# EAGLE design PLA_Main_Gen2_Rev4_BOMREV2 (EAGLE 7.7.0)

## Sheet 1 of 2: Atmega
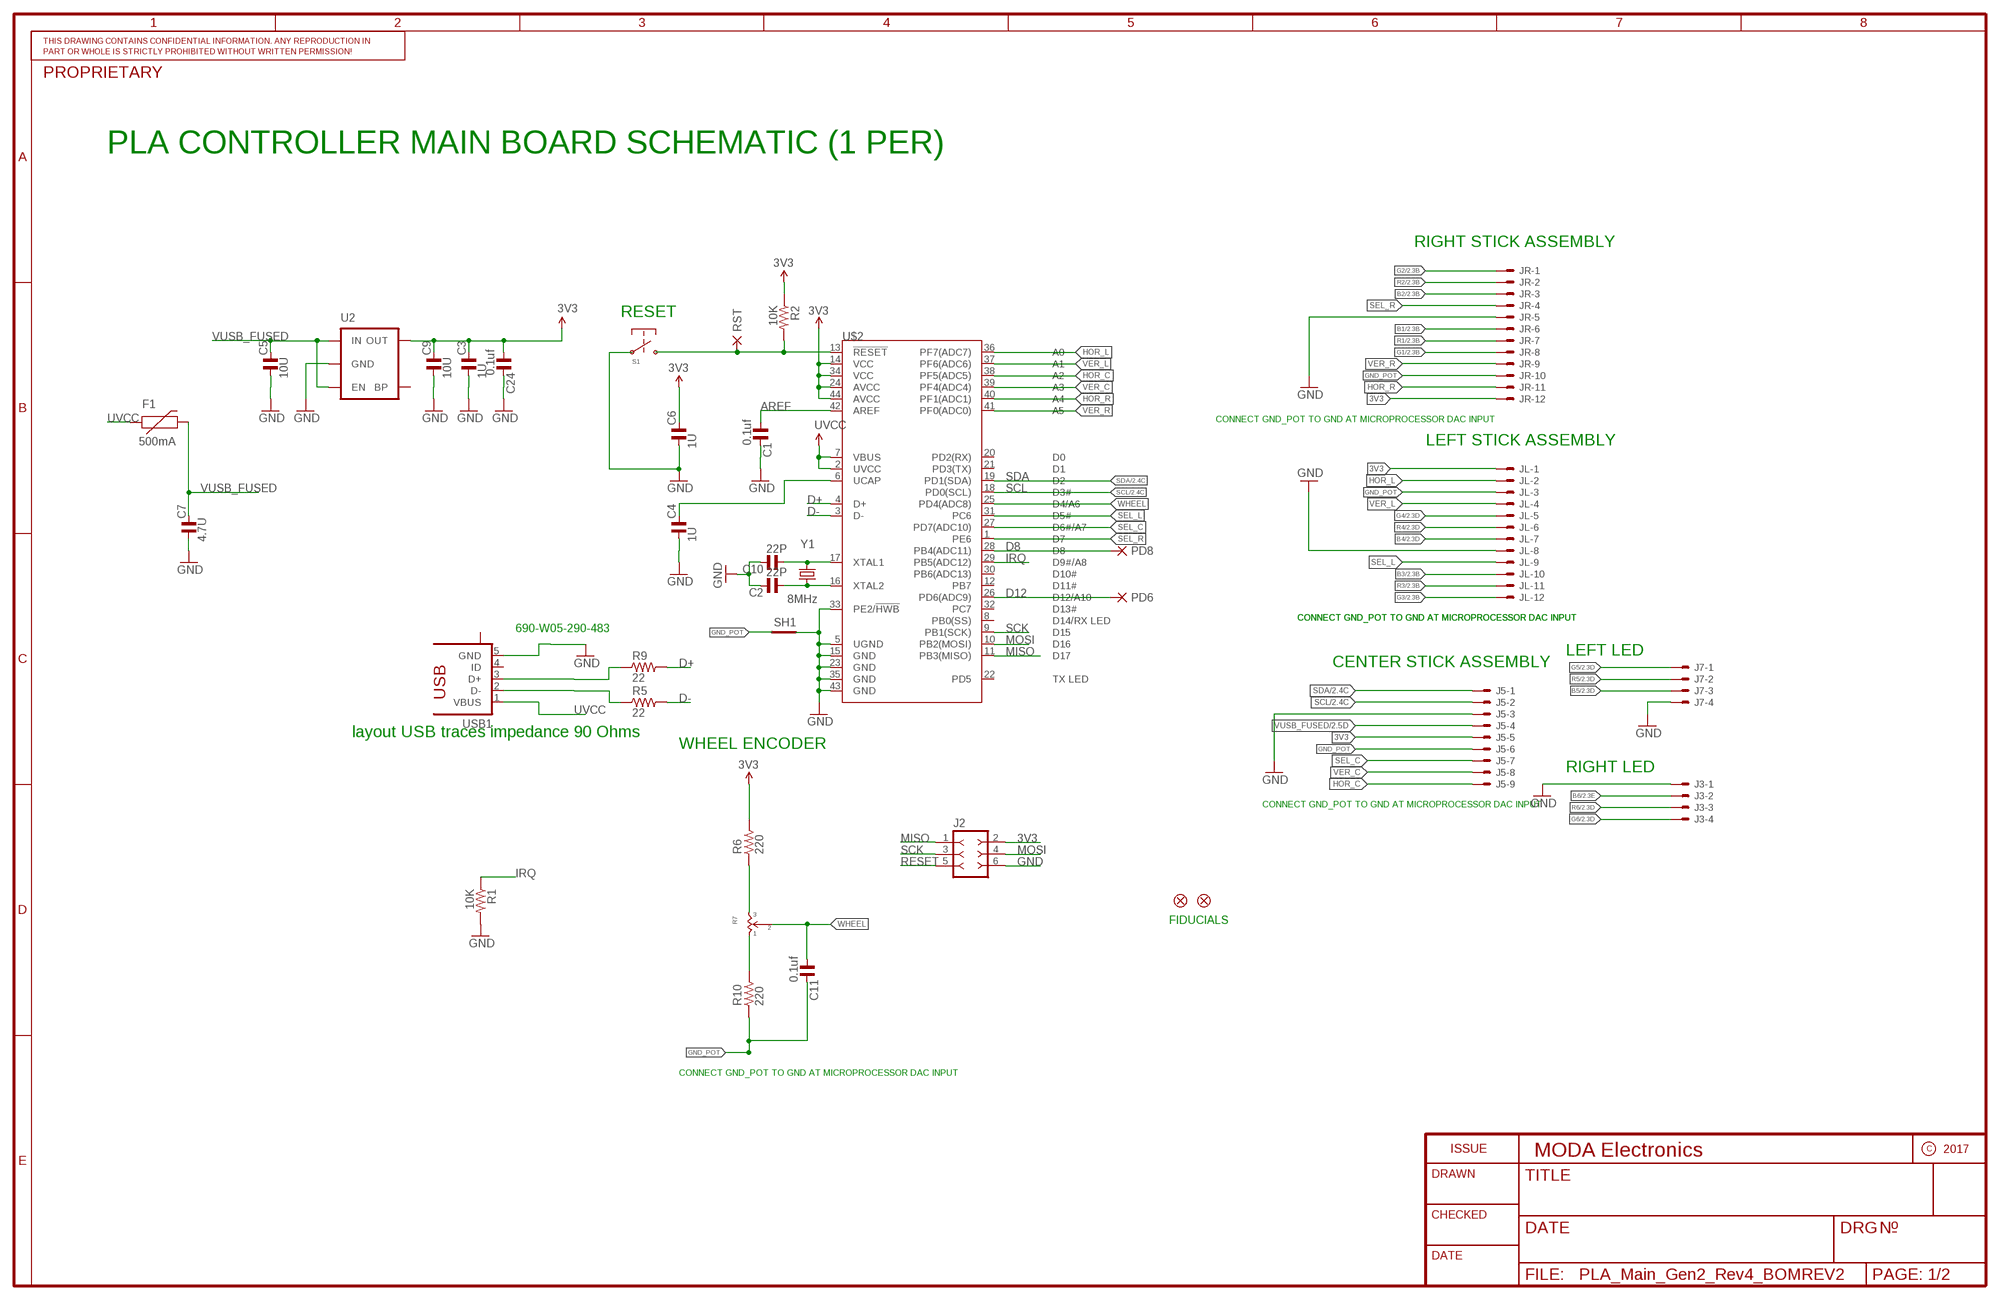
[diagram p0: schematic, sheet 1]

### Parts
C1  0.1uf  C_0603  [C0603]
C2  22P  C_0603  [C0603]
C3  1U  C_0603  [C0603]
C4  1U  C_0603  [C0603]
C5  10U  C_1206  [C1206]
C6  1U  C_0603  [C0603]
C7  4.7U  C_0603  [C0603]
C9  10U  C_1206  [C1206]
C10  22P  C_0603  [C0603]
C11  0.1uf  C_0603  [C0603]
C24  0.1uf  C_0603  [C0603]
F1  500mA  PTCSMD  [PTC-1206]
J2  F-2X03-DIL-100  [DIL-100-2X03]
J3  SM04B-SRSS-TB  [SM04B-SRSS-TB]
J5  SM09B-SRSS-TB  [SM09B-SRSS-TB]
J7  SM04B-SRSS-TB  [SM04B-SRSS-TB]
JL  SM12B-SRSS-TB  [SM12B-SRSS-TB]
JP1  FIDUCIALUFIDUCIAL  [MICRO-FIDUCIAL]
JP2  FIDUCIALUFIDUCIAL  [MICRO-FIDUCIAL]
JR  SM12B-SRSS-TB  [SM12B-SRSS-TB]
PD6  PAD-SMD12R  [SMD12R]
PD8  PAD-SMD12R  [SMD12R]
R1  10K  R_0603  [R0603]
R2  10K  R_0603  [R0603]
R5  22  R_0603  [R0603]
R6  220  R_0603  [R0603]
R7  SV01A103AEA01R00  [SV01A103AEA01R00]
R9  22  R_0603  [R0603]
R10  220  R_0603  [R0603]
RST  PAD-SMD10R  [SMD10R]
S1  KMR211GLFS  [KMR211GLFS]
SH1  SHORTT5  [SHORT_TOP-50]
U2  V_REG_LDOSMD  [SOT23-5]
U$2  ATMEGA32U4QFN  [QFN-44]
USB1  10118192-0001LF  [10118192-0001LF]
Y1  8MHz  CRYSTAL5X3  [CRYSTAL-SMD-5X3]

### Nets
3V3: C3.2 C6.2 C9.2 C24.1 J2.2 J5.5 JL.1 JR.12 R2.1 R6.2 U2.5(OUT) U$2.14(VCC) U$2.24(AVCC) U$2.34(VCC) U$2.44(AVCC) ; also sheet 2
AREF: C1.1 U$2.42(AREF)
B1: JR.6 ; also sheet 2
B2: JR.3 ; also sheet 2
B3: JL.10 ; also sheet 2
B4: JL.7 ; also sheet 2
B5: J7.3 ; also sheet 2
B6: J3.2 ; also sheet 2
D8: PD8.PAD(P) U$2.28(PB4(ADC11))
D12: PD6.PAD(P) U$2.26(PD6(ADC9))
D+ [diff90]: R9.2 U$2.4(D+)
D- [diff90]: R5.2 U$2.3(D-)
G1: JR.8 ; also sheet 2
G2: JR.1 ; also sheet 2
G3: JL.12 ; also sheet 2
G4: JL.5 ; also sheet 2
G5: J7.1 ; also sheet 2
G6: J3.4 ; also sheet 2
GND [vcc]: C1.2 C2.2 C3.1 C4.1 C5.1 C6.1 C7.1 C9.1 C10.2 C24.2 J2.6 J3.1 J5.3 J7.4 JL.8 JR.5 R1.2 S1.1A S1.1B SH1.2 U2.2(GND) U$2.5(UGND) U$2.15(GND) U$2.23(GND) U$2.33(PE2/!HWB) U$2.35(GND) U$2.43(GND) USB1.5(GND) ; also sheet 2
GND_POT [vcc]: C11.2 J5.6 JL.3 JR.10 R10.1 SH1.1
HOR_C: J5.9 U$2.38(PF5(ADC5))
HOR_L: JL.2 U$2.36(PF7(ADC7))
HOR_R: JR.11 U$2.40(PF1(ADC1))
IRQ: R1.1 U$2.29(PB5(ADC12))
MISO: J2.1 U$2.11(PB3(MISO))
MOSI: J2.4 U$2.10(PB2(MOSI))
N$1: C2.1 U$2.16(XTAL2) Y1.1
N$2: C10.1 U$2.17(XTAL1) Y1.3
N$4: C4.2 U$2.6(UCAP)
N$7: R6.1 R7.3
N$10: R7.1 R10.2
R1: JR.7 ; also sheet 2
R2: JR.2 ; also sheet 2
R3: JL.11 ; also sheet 2
R4: JL.6 ; also sheet 2
R5: J7.2 ; also sheet 2
R6: J3.3 ; also sheet 2
RESET: J2.5 R2.2 RST.PAD(P) S1.2A S1.2B U$2.13(!RESET)
SCK: J2.3 U$2.9(PB1(SCK))
SCL: J5.2 U$2.18(PD0(SCL)) ; also sheet 2
SDA: J5.1 U$2.19(PD1(SDA)) ; also sheet 2
SEL_C: J5.7 U$2.27(PD7(ADC10))
SEL_L: JL.9 U$2.31(PC6)
SEL_R: JR.4 U$2.1(PE6)
USB_N [diff90]: R5.1 USB1.2(D-)
USB_P [diff90]: R9.1 USB1.3(D+)
UVCC: F1.1 U$2.2(UVCC) U$2.7(VBUS) USB1.1(VBUS)
VER_C: J5.8 U$2.39(PF4(ADC4))
VER_L: JL.4 U$2.37(PF6(ADC6))
VER_R: JR.9 U$2.41(PF0(ADC0))
VUSB_FUSED: C5.2 C7.2 F1.2 J5.4 U2.1(IN) U2.3(EN) ; also sheet 2
WHEEL: C11.1 R7.2 R7.2A U$2.25(PD4(ADC8))
Unconnected: U2.4(BP) U$2.8(PB0(SS)) U$2.12(PB7) U$2.20(PD2(RX)) U$2.21(PD3(TX)) U$2.22(PD5) U$2.30(PB6(ADC13)) U$2.32(PC7) USB1.4(ID) USB1.M1(S) USB1.M2(S) USB1.S1(S) USB1.S2(S) USB1.S3(S) USB1.S4(S)

### Notes on the sheet
- PLA CONTROLLER MAIN BOARD SCHEMATIC (1 PER)
- RIGHT STICK ASSEMBLY
- RESET
- CONNECT GND_POT TO GND AT MICROPROCESSOR DAC INPUT
- LEFT STICK ASSEMBLY
- CONNECT GND_POT TO GND AT MICROPROCESSOR DAC INPUT | CONNECT GND_POT TO GND AT MICROPROCESSOR DAC INPUT
- 690-W05-290-483
- LEFT LED
- CENTER STICK ASSEMBLY
- layout USB traces impedance 90 Ohms
- WHEEL ENCODER
- RIGHT LED
- CONNECT GND_POT TO GND AT MICROPROCESSOR DAC INPUT
- FIDUCIALS
- CONNECT GND_POT TO GND AT MICROPROCESSOR DAC INPUT

## Sheet 2 of 2: Color LED
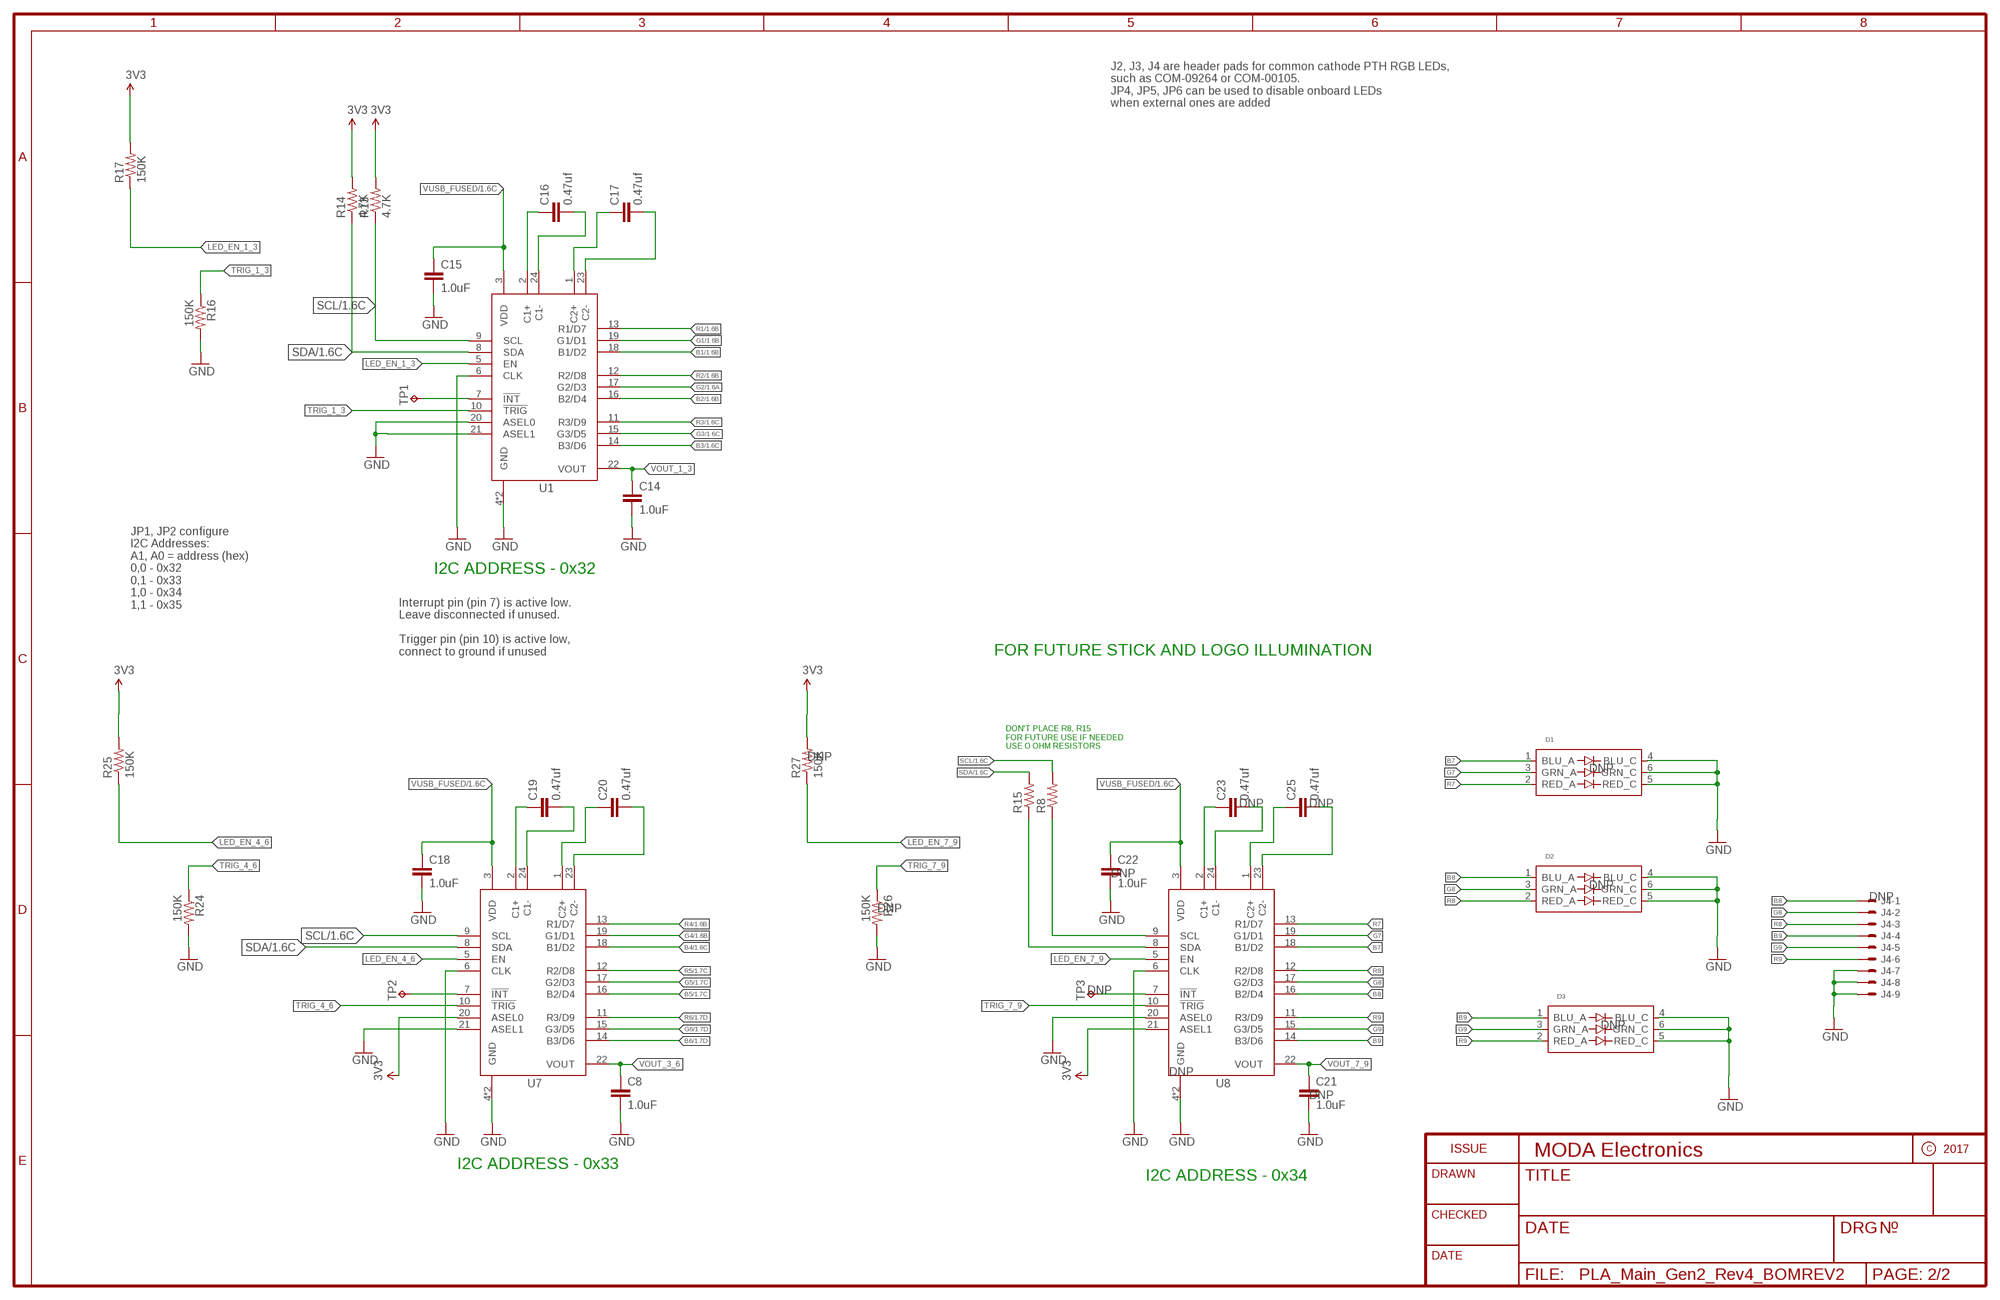
[diagram p1: schematic, sheet 2]

### Parts
C8  1.0uF  1.0UF-16V-10%(0603)  [0603-CAP]
C14  1.0uF  1.0UF-16V-10%(0603)  [0603-CAP]
C15  1.0uF  1.0UF-16V-10%(0603)  [0603-CAP]
C16  0.47uf  CAP0603-CAP  [0603-CAP]
C17  0.47uf  CAP0603-CAP  [0603-CAP]
C18  1.0uF  1.0UF-16V-10%(0603)  [0603-CAP]
C19  0.47uf  CAP0603-CAP  [0603-CAP]
C20  0.47uf  CAP0603-CAP  [0603-CAP]
C21  1.0uF  1.0UF-16V-10%(0603)  [0603-CAP]
C22  1.0uF  1.0UF-16V-10%(0603)  [0603-CAP]
C23  0.47uf  CAP0603-CAP  [0603-CAP]
C25  0.47uf  CAP0603-CAP  [0603-CAP]
D1  XZFBBM2ACRDG92W-3  [XZFBBM2ACRDG92W-3]
D2  XZFBBM2ACRDG92W-3  [XZFBBM2ACRDG92W-3]
D3  XZFBBM2ACRDG92W-3  [XZFBBM2ACRDG92W-3]
J4  BM09B-SRSS-TB  [BM09B-SRSS-TB]
R8  4.7KOHM-1/10W-1%(0603)  [0603-RES]
R13  4.7K  4.7KOHM-1/10W-1%(0603)  [0603-RES]
R14  4.7K  4.7KOHM-1/10W-1%(0603)  [0603-RES]
R15  4.7KOHM-1/10W-1%(0603)  [0603-RES]
R16  150K  150KOHM1/10W1%(0603)  [0603-RES]
R17  150K  150KOHM1/10W1%(0603)  [0603-RES]
R24  150K  150KOHM1/10W1%(0603)  [0603-RES]
R25  150K  150KOHM1/10W1%(0603)  [0603-RES]
R26  150K  150KOHM1/10W1%(0603)  [0603-RES]
R27  150K  150KOHM1/10W1%(0603)  [0603-RES]
TP1  TP-040  [TP-040]
TP2  TP-040  [TP-040]
TP3  TP-040  [TP-040]
U1  LP55231WQFN  [WQFN-24]
U7  LP55231WQFN  [WQFN-24]
U8  LP55231WQFN  [WQFN-24]

### Nets
3V3: R13.2 R14.2 R17.2 R25.2 R27.2 U7.20(ASEL0) U8.21(ASEL1) ; also sheet 1
B1: U1.18(B1/D2) ; also sheet 1
B2: U1.16(B2/D4) ; also sheet 1
B3: U1.14(B3/D6) ; also sheet 1
B4: U7.18(B1/D2) ; also sheet 1
B5: U7.16(B2/D4) ; also sheet 1
B6: U7.14(B3/D6) ; also sheet 1
B7: D1.1(BLU_A) U8.18(B1/D2)
B8: D2.1(BLU_A) J4.1 U8.16(B2/D4)
B9: D3.1(BLU_A) J4.4 U8.14(B3/D6)
G1: U1.19(G1/D1) ; also sheet 1
G2: U1.17(G2/D3) ; also sheet 1
G3: U1.15(G3/D5) ; also sheet 1
G4: U7.19(G1/D1) ; also sheet 1
G5: U7.17(G2/D3) ; also sheet 1
G6: U7.15(G3/D5) ; also sheet 1
G7: D1.3(GRN_A) U8.19(G1/D1)
G8: D2.3(GRN_A) J4.2 U8.17(G2/D3)
G9: D3.3(GRN_A) J4.5 U8.15(G3/D5)
GND [vcc]: C8.2 C14.2 C15.2 C18.2 C21.2 C22.2 D1.4(BLU_C) D1.5(RED_C) D1.6(GRN_C) D2.4(BLU_C) D2.5(RED_C) D2.6(GRN_C) D3.4(BLU_C) D3.5(RED_C) D3.6(GRN_C) J4.7 J4.8 J4.9 R16.2 R24.2 R26.2 U1.4(GND) U1.6(CLK) U1.20(ASEL0) U1.21(ASEL1) U1.EP(GND) U7.4(GND) U7.6(CLK) U7.21(ASEL1) U7.EP(GND) U8.4(GND) U8.6(CLK) U8.20(ASEL0) U8.EP(GND) ; also sheet 1
LED_EN_1_3: R17.1 U1.5(EN)
LED_EN_4_6: R25.1 U7.5(EN)
LED_EN_7_9: R27.1 U8.5(EN)
N$3: TP1.1 U1.7(!INT)
N$5: C19.1 U7.2(C1+)
N$9: C19.2 U7.24(C1-)
N$11: C16.1 U1.2(C1+)
N$12: C16.2 U1.24(C1-)
N$13: C17.1 U1.1(C2+)
N$14: C17.2 U1.23(C2-)
N$21: C20.1 U7.1(C2+)
N$22: C20.2 U7.23(C2-)
N$23: TP2.1 U7.7(!INT)
N$24: C23.1 U8.2(C1+)
N$25: C23.2 U8.24(C1-)
N$26: C25.1 U8.1(C2+)
N$27: C25.2 U8.23(C2-)
N$28: TP3.1 U8.7(!INT)
R1: U1.13(R1/D7) ; also sheet 1
R2: U1.12(R2/D8) ; also sheet 1
R3: U1.11(R3/D9) ; also sheet 1
R4: U7.13(R1/D7) ; also sheet 1
R5: U7.12(R2/D8) ; also sheet 1
R6: U7.11(R3/D9) ; also sheet 1
R7: D1.2(RED_A) U8.13(R1/D7)
R8: D2.2(RED_A) J4.3 U8.12(R2/D8)
R9: D3.2(RED_A) J4.6 U8.11(R3/D9)
SCL: R8.2 R13.1 U1.9(SCL) U7.9(SCL) ; also sheet 1
SCL2: R8.1 U8.9(SCL)
SDA: R14.1 R15.2 U1.8(SDA) U7.8(SDA) ; also sheet 1
SDA2: R15.1 U8.8(SDA)
TRIG_1_3: R16.1 U1.10(!TRIG)
TRIG_4_6: R24.1 U7.10(!TRIG)
TRIG_7_9: R26.1 U8.10(!TRIG)
VOUT_1_3: C14.1 U1.22(VOUT)
VOUT_3_6: C8.1 U7.22(VOUT)
VOUT_7_9: C21.1 U8.22(VOUT)
VUSB_FUSED: C15.1 C18.1 C22.1 U1.3(VDD) U7.3(VDD) U8.3(VDD) ; also sheet 1

### Notes on the sheet
- J2, J3, J4 are header pads for common cathode PTH RGB LEDs,
  such as COM-09264 or COM-00105.  
  JP4, JP5, JP6 can be used to disable onboard LEDs 
  when external ones are added
- I2C ADDRESS - 0x32
- JP1, JP2 configure
  I2C Addresses:
  A1, A0 = address (hex)
  0,0 - 0x32
  0,1 - 0x33
  1,0 - 0x34
  1,1 - 0x35
- Interrupt pin (pin 7) is active low.  
  Leave disconnected if unused.
  
  Trigger pin (pin 10) is active low, 
  connect to ground if unused
- FOR FUTURE STICK AND LOGO ILLUMINATION
- DON'T PLACE R8, R15 
  FOR FUTURE USE IF NEEDED
  USE O OHM RESISTORS
- I2C ADDRESS - 0x33
- I2C ADDRESS - 0x34

## Library data of the parts
C1 C11 C24 = rc-master-smd:C_: NON-POLARIZED CAP; PARTNO: 64K2839
C2 C10 = rc-master-smd:C_: NON-POLARIZED CAP; PARTNO: 06035C220JAT2A
C3 C4 C6 = rc-master-smd:C_: NON-POLARIZED CAP; PARTNO: CL10B105KP8NNNC
C5 C9 = rc-master-smd:C_: NON-POLARIZED CAP; PARTNO: C3216X5R1H106K160AB
C7 = rc-master-smd:C_: NON-POLARIZED CAP; PARTNO: GRM188R61A475KE15D
C8 C14 C15 C18 = SparkFun-Capacitors:1.0UF-16V-10%(0603): CAP-00868; PARTNO: CL10B105KP8NNNC; PROD_ID: CAP-00868
C16 C19 = SparkFun-Capacitors:CAP: Capacitor Standard 0603 ceramic capacitor, and 0.1" leaded capacitor.; PARTNO: 0603YG474ZAT2A; PROD_ID: CAP-13216; SEE-ALSO: battery-babysitter
C17 C20 = SparkFun-Capacitors:CAP: Capacitor Standard 0603 ceramic capacitor, and 0.1" leaded capacitor.; PARTNO: 0603YG474ZAT2A; PROD_ID: CAP-13216; SEE-ALSO: battery bayasitter
C21 C22 = SparkFun-Capacitors:1.0UF-16V-10%(0603): CAP-00868; DNP: T; PARTNO: CL10B105KP8NNNC; PROD_ID: CAP-00868
C23 = SparkFun-Capacitors:CAP: Capacitor Standard 0603 ceramic capacitor, and 0.1" leaded capacitor.; DNP: T; PARTNO: 0603YG474ZAT2A; PROD_ID: CAP-13216; SEE-ALSO: battery-babysitter
C25 = SparkFun-Capacitors:CAP: Capacitor Standard 0603 ceramic capacitor, and 0.1" leaded capacitor.; DNP: T; PARTNO: 0603YG474ZAT2A; PROD_ID: CAP-13216; SEE-ALSO: battery bayasitter
D1-D3 = XZFBBM2ACRDG92W-3:XZFBBM2ACRDG92W-3: Red, Green, Blue (RGB) 625nm Red, 525nm Green, 470nm Blue LED Indication - Discrete 2.2V Red, 3.2V Green, 3.3V Blue 6-SMD, No Lead ( https://www.digikey.com/product-detail/en/sunled/XZFBBM2ACRDG92W-3/1497-1226-1-ND/5001279 ); DNP: T; PARTNO: XZFBBM2ACRDG92W-3
F1 = SparkFun:PTC: Resettable Fuse PTC Resettable Fuse. Spark Fun Electronics SKU : COM-08357; PARTNO: NANOSMDH075F-02
J2 = con-headers-jp:F-2X03-: FEMALE HEADER; DNP: T; PARTNO: *
J3 J7 = con-jst:?M04B-SRSS-TB: Disconnectable Crimp style connector, 1.0mm pitch 4 contacts; PARTNO: SM04B-SRSS-TB(LF)(SN)
J4 = con-jst:?M09B-SRSS-TB: Disconnectable Crimp style connector, 1.0mm pitch 9 contacts; DNP: T; PARTNO: BM09B-SRSS-TB
J5 = con-jst:?M09B-SRSS-TB: Disconnectable Crimp style connector, 1.0mm pitch 9 contacts; PARTNO: SM09B-SRSS-TB
JL JR = con-jst:?M12B-SRSS-TB: Disconnectable Crimp style connector, 1.0mm pitch 12 contacts; PARTNO: SM12B-SRSS-TB(LF)(SN)
JP1 JP2 = SparkFun:FIDUCIAL: Fiducial Alignment Points Various fiducial points for machine vision alignment.; DNP: T; PARTNO: *
PD6 PD8 RST = dpads:PAD: WIRE PAD Standard US Drill Sizes and SMD pads; BOM: EXCLUDE
R1 R2 = rc-master-smd:R_: RESISTOR; PARTNO: ERJ-PA3J103V
R5 R9 = rc-master-smd:R_: RESISTOR; PARTNO: ERJ-PA3J220V
R6 R10 = rc-master-smd:R_: RESISTOR; PARTNO: ERJ-PA3J221V
R7 = SV01A103AEA01R00:SV01A103AEA01R00: Resistive Sensor Rotary Position Hole for Shaft SMD (SMT) Tab ( https://www.digikey.in/product-detail/en/murata-electronics-north-america/SV01A103AEA01R00/490-7023-1-ND/3846220 ); PARTNO: SV01A103AEA01R00
R8 R15 = SparkFun-Resistors:4.7KOHM-1/10W-1%(0603): RES-07857; DNP: T; PARTNO: ERJ-PA3J472V; PROD_ID: RES-07857; VALUE: 4.7K
R13 R14 = SparkFun-Resistors:4.7KOHM-1/10W-1%(0603): RES-07857; PARTNO: ERJ-PA3J472V; PROD_ID: RES-07857
R16 R17 R24 R25 = SparkFun-Resistors:150KOHM1/10W1%(0603): RES-09117; PARTNO: ERJ-PA3J154V; PROD_ID: RES-09117
R26 R27 = SparkFun-Resistors:150KOHM1/10W1%(0603): RES-09117; DNP: T; PARTNO: ERJ-PA3J154V; PROD_ID: RES-09117
S1 = KMR211GLFS:KMR211GLFS: Tactile Switch SPST-NO Top Actuated Surface Mount ( https://www.digikey.in/product-detail/en/c-k/KMR211GLFS/401-1426-1-ND/550461 ); PARTNO: KMR211GLFS
SH1 = shorts:SHORT: Short between two nets; BOM: no; DNP: T; PARTNO: *
TP1-TP3 = keystone:TP: TEST POINT PCB Vertical Mount; DNP: T; PARTNO: *
U1 U7 = LP55231:LP55231; PARTNO: LP55231SQX/NOPB; PROD_ID: IC-13302
U2 = SparkFun:V_REG_LDO: Voltage Regulator LDO Standard 150mA LDO voltage regulator in SOT-23 layout. Micrel part MIC5205. BP (by-pass) pin is used to lower output noise with 470pF cap.; PARTNO: MIC5219-3.3YM5-TR
U8 = LP55231:LP55231; DNP: T; PARTNO: LP55231SQX/NOPB; PROD_ID: IC-13302
U$2 = PLA_Controller_rev1:ATMEGA32U4: Atmel 44-pin 8-bit Microcontroller with 32KBytes of ISP Flash and USB Controller; PARTNO: ATMEGA32U4-MU
USB1 = Wagz_flex_rev22_test:10118192-0001LF: USB - microUSB Type B, FCI; PARTNO: 10118192-0001LF
Y1 = SparkFun:CRYSTAL: Crystals Various standard crystals. Proven footprints. Spark Fun Electronics SKU : COM-00534; PARTNO: ABM3B-8.000MHZ-B2-T

## Net classes
0 default: width 0.203 mm, drill 0.305 mm, clearance 0.178 mm
1 vcc: width 0.203 mm, drill 0.305 mm, clearance 0.178 mm
3 diff90: width 0.406 mm, drill 0.356 mm, clearance 0.254 mm

## Board
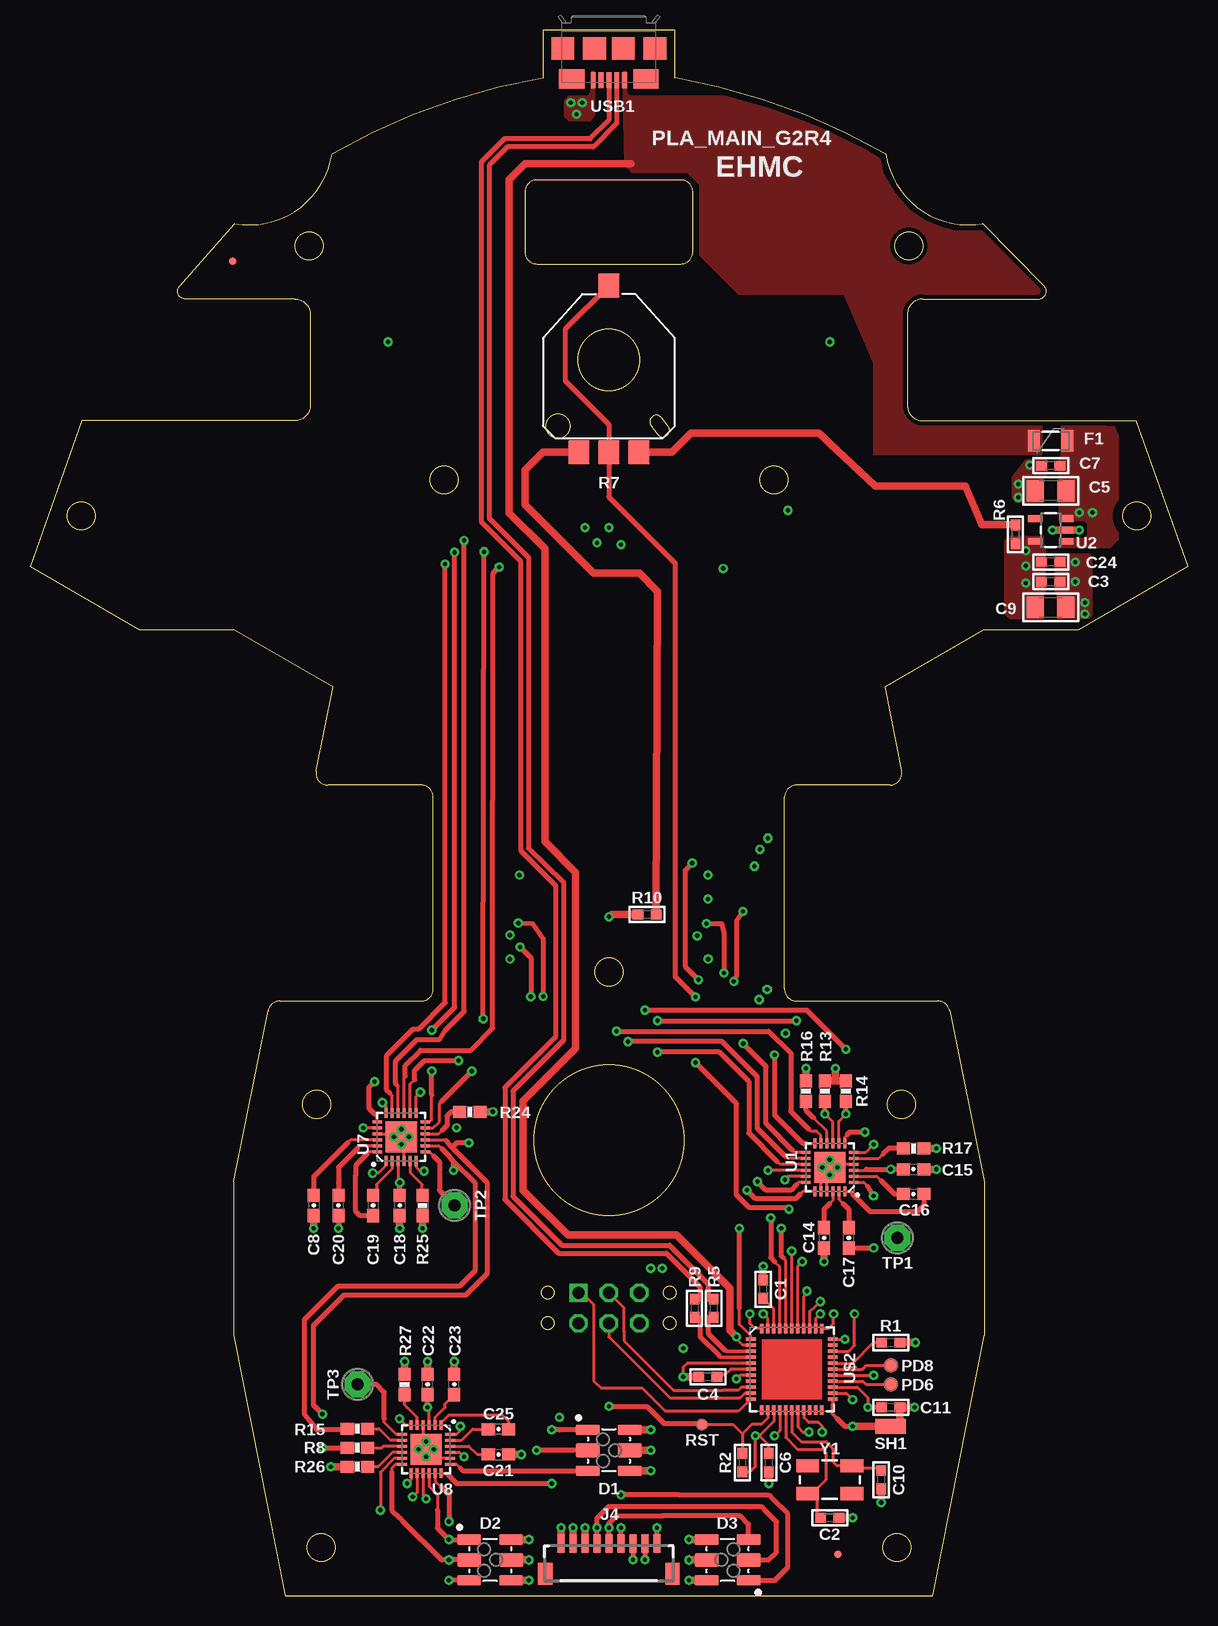
[diagram p2: board, top side]
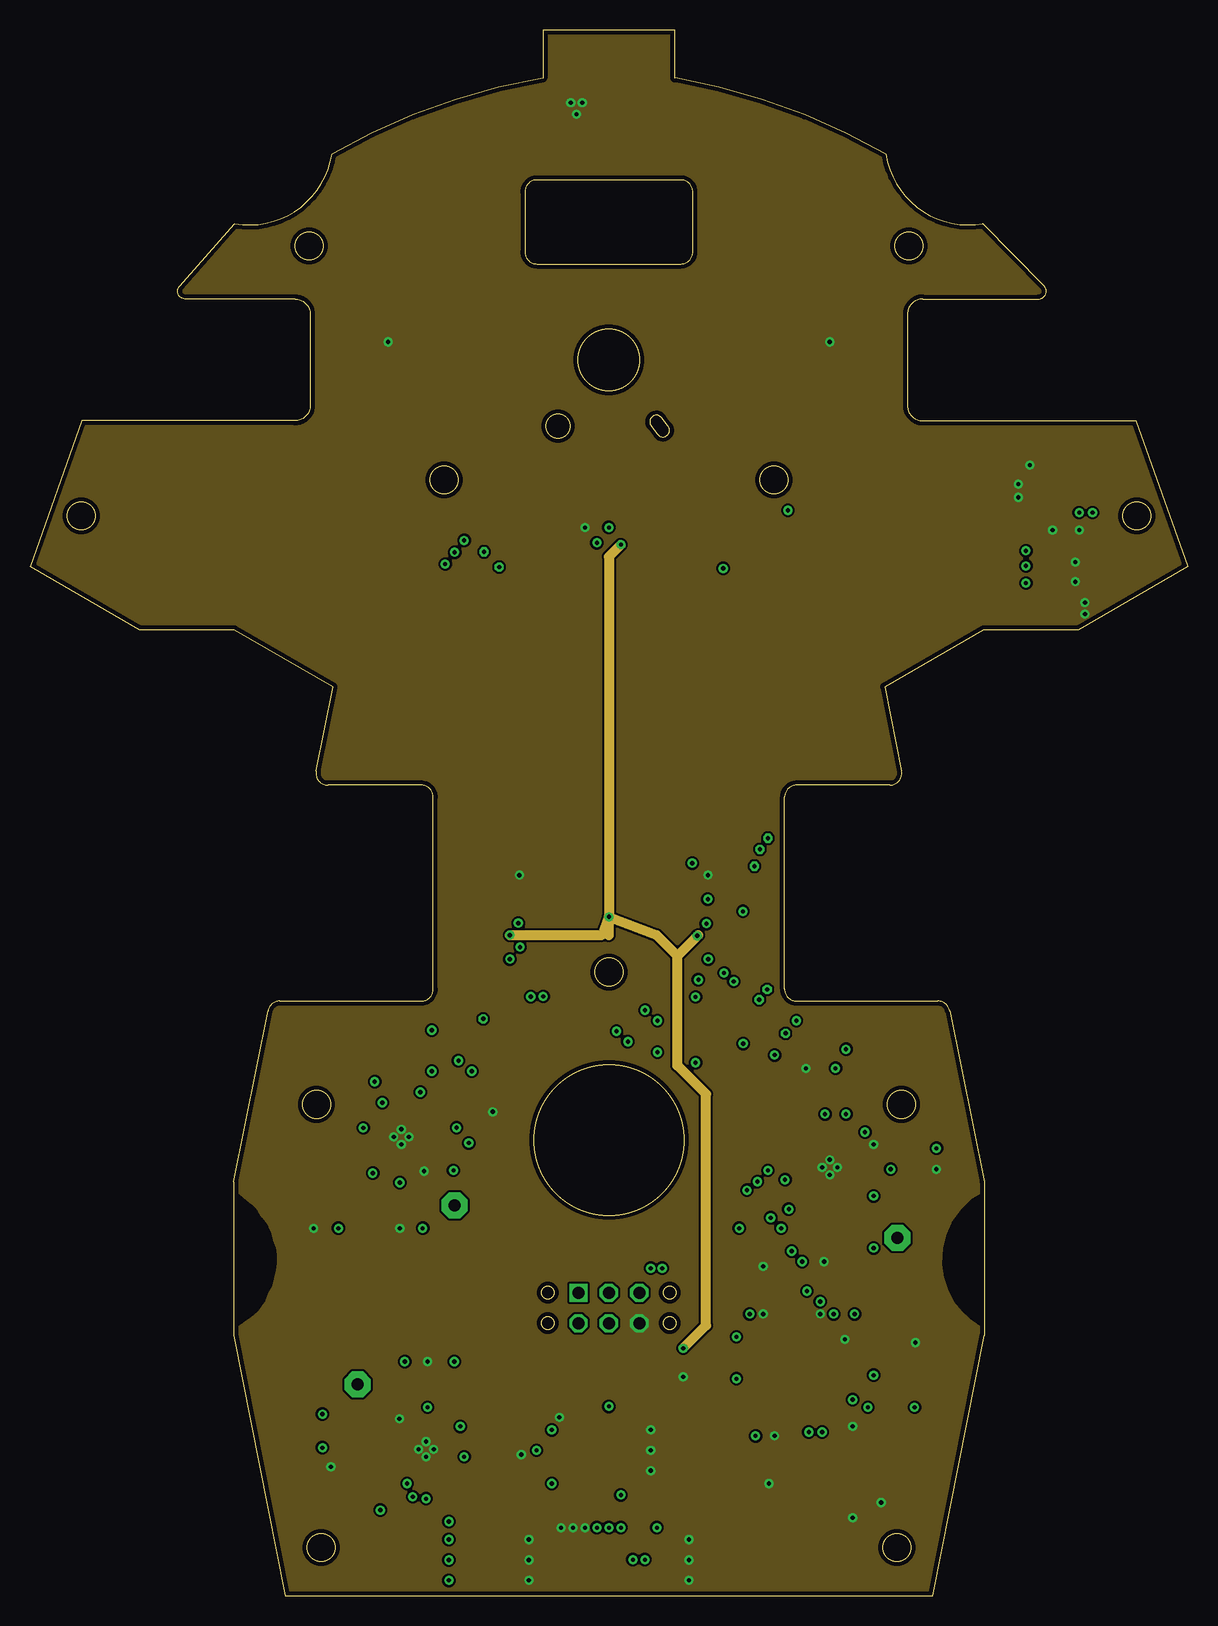
[diagram p3: board, inner layer GND]
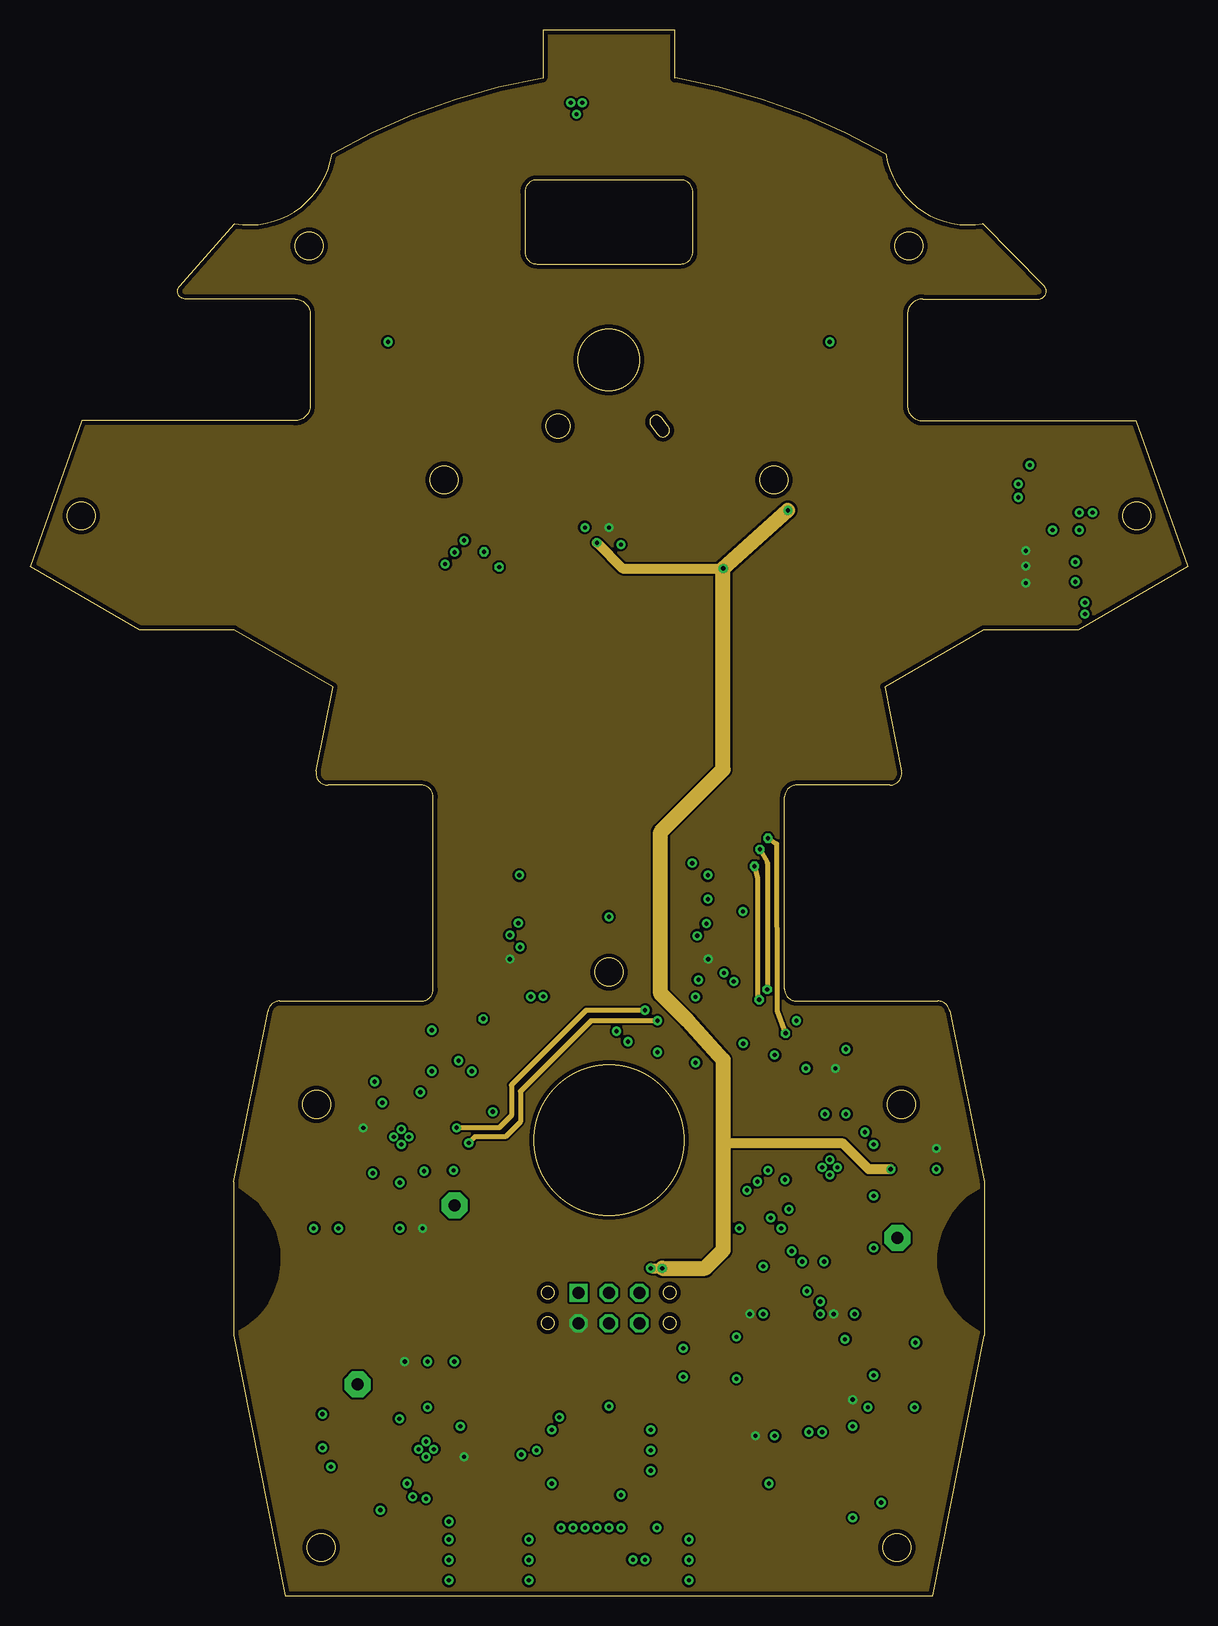
[diagram p4: board, inner layer Route15]
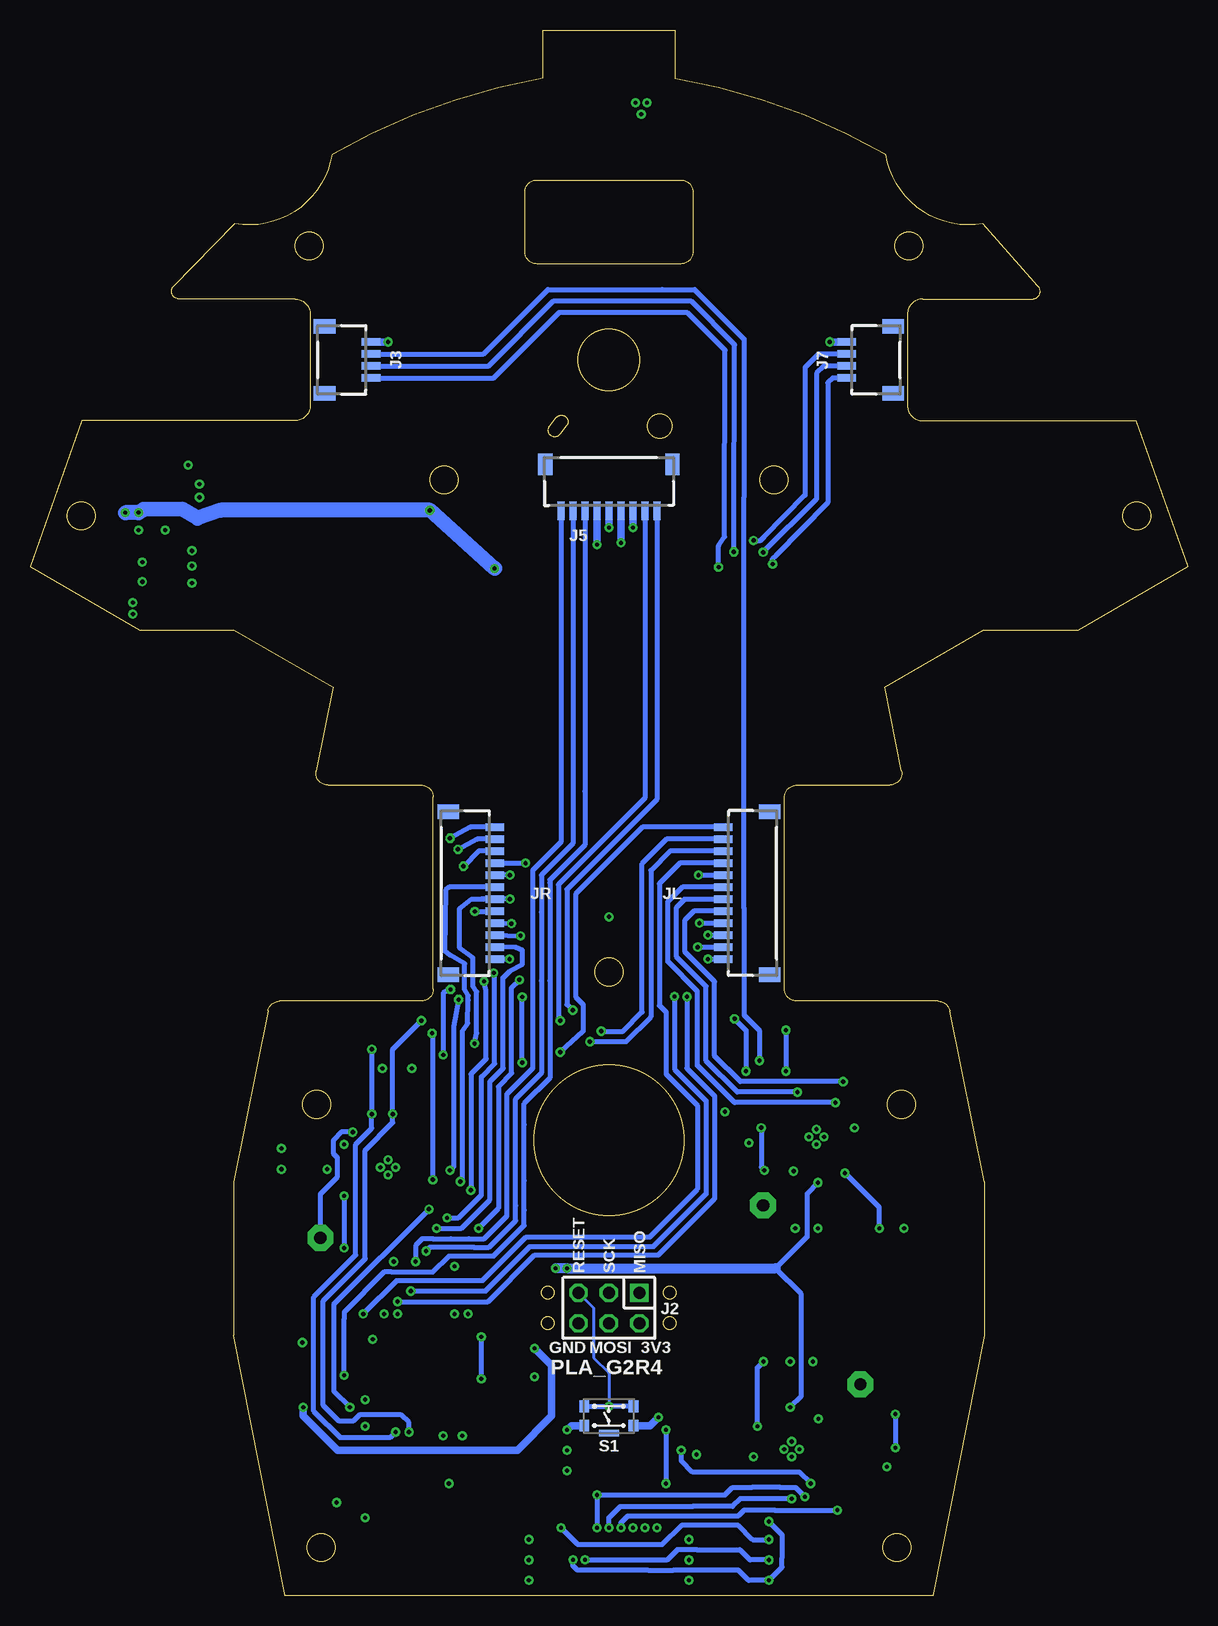
[diagram p5: board, bottom side, seen from below]

Size 96.52 x 130.5 mm. Coordinates in mm from the lower left corner, seen from the top.
Outline: 52.33,96.79 arc180 53.2,97.46 52.65,98.18 arc180 51.78,97.51 52.33,96.79
Outline: 41.26,117 41.26,112 arc90 42.26,111 54.26,111 arc90 55.26,112 55.26,117 arc90 54.26,118 42.26,118 arc90 41.26,117
Outline: 25.26,75.75 17.03,80.5 9.14,80.5 0,85.78 4.32,97.92 22.1,97.92 arc90 23.37,99.19 23.37,106.81 arc90 22.1,108.08 12.94,108.08 arc-134 12.49,109.16 17.07,114.35 arc91 25.17,120.13 arc-20 42.76,126.5 42.76,130.5 53.76,130.5 53.76,126.5 arc-20 71.35,120.13 arc91 79.46,114.35 84.54,109.16 arc-134 84.09,108.08 74.42,108.08 arc90 73.15,106.81 73.15,99.19 arc90 74.42,97.92 92.2,97.92 96.52,85.78 87.38,80.5 79.49,80.5 71.26,75.75 72.66,68.75 arc-101 71.68,67.55 63.9,67.55 arc90 62.9,66.55 62.9,50.55 arc90 63.9,49.55 75.69,49.55 arc-79 76.67,48.75 79.56,34.5 79.56,21.7 75.26,0 21.26,0 16.96,21.7 16.96,34.5 19.85,48.75 arc-79 20.83,49.55 32.62,49.55 arc90 33.62,50.55 33.62,66.55 arc90 32.62,67.55 24.84,67.55 arc-101 23.86,68.75 25.26,75.75
Outline: circle at 48.26,103 radius 2.55
Outline: circle at 48.26,37.96 radius 6.25
Outline: circle at 44.03,97.49 radius 1
Outline: circle at 34.51,93 radius 1.15
Outline: circle at 73.26,112.5 radius 1.15
Outline: circle at 92.26,90 radius 1.15
Outline: circle at 4.26,90 radius 1.15
Outline: circle at 72.26,4 radius 1.15
Outline: circle at 48.26,51.97 radius 1.15
Outline: circle at 23.88,40.94 radius 1.15
Outline: circle at 23.26,112.5 radius 1.15
Outline: circle at 24.26,4 radius 1.15
Outline: circle at 72.64,40.94 radius 1.15
Outline: circle at 62.01,93 radius 1.15
Outline: circle at 53.34,25.23 radius 0.51
Outline: circle at 43.18,25.23 radius 0.51
Outline: circle at 53.34,22.69 radius 0.51
Outline: circle at 43.18,22.69 radius 0.51
Copper layers (1+2*15+16): Top 0.035mm / dielectric 0.3mm / GND 0.035mm / dielectric 0.85mm / Route15 0.035mm / dielectric 0.3mm / Bottom 0.035mm
Design rules "SSC-EAGLE-4Lyr_v1.0.0.3 *": minimum track width 7mil, minimum drill 12mil, track to track 7mil, track to pad 7mil, pad to pad 7mil, via to via 8mil, smd to smd 0mil, copper to edge 15mil, drill to drill 16mil, minimum pad ring 8mil, minimum via ring 8mil, stop-mask expansion 3mil, vias tented up to drill 14mil, thermal gap 10mil
bKeepout: area 67,0.1 to 79.2,22.4; area 17.3,0.1 to 29.5,22.4; area 37.5,16.7 to 59.1,31.2; area 17,31.5 to 28.6,46.5; area 67.9,31.5 to 79.5,46.5; area 0.6,85.5 to 9.8,93.8; area 90.5,85.5 to 95.9,93.8
tRestrict: area -63.6,-44.7 to -62.9,-44.6; area 2.3,88 to 6.3,92; area 90.3,88 to 94.3,92; area 46.3,50 to 50.3,54; area 21.9,38.9 to 25.9,42.9; area 70.6,38.9 to 74.6,42.9; area 70.3,2 to 74.3,6; area 22.3,2 to 26.3,6
bRestrict: area 2.3,88 to 6.3,92; area 90.3,88 to 94.3,92; area 46.3,50 to 50.3,54; area 21.9,38.9 to 25.9,42.9; area 70.6,38.9 to 74.6,42.9; area 70.3,2 to 74.3,6; area 22.3,2 to 26.3,6

### Footprints (pad centres in the part's own frame; a part is rotated, then mirrored left to right if it is on the bottom)
C0603 = smd 0.9 x 0.8: 1 -0.762,0; 2 0.762,0
C1206 = smd 1.4 x 1.8: 1 -1.27,0; 2 1.27,0
0603-CAP = smd 1.1 x 1: 1 -0.85,0; 2 0.85,0
XZFBBM2ACRDG92W-3 = smd 2 x 0.9: 1 -1.75,1.7; 3 -1.75,-1.7; 4 1.75,1.7; 6 1.75,-1.7 | smd 2 x 1.2: 2 -1.75,0; 5 1.75,0
PTC-1206 = smd 1 x 1.8: 1 -1.4,0; 2 1.4,0
DIL-100-2X03 = drill 1.016 square: 1 -2.54,-1.27 | drill 1.016 octagon: 2 -2.54,1.27; 3 0,-1.27; 4 0,1.27; 5 2.54,-1.27; 6 2.54,1.27
SM04B-SRSS-TB = smd 0.6 x 1.55: 1 -1.5,2.975; 2 -0.5,2.975; 3 0.5,2.975; 4 1.5,2.975 | smd 1.2 x 1.8: FIT@1 -2.8,-0.9; FIT@2 2.8,-0.9
BM09B-SRSS-TB = smd 0.6 x 1.55: 1 -4,-1.625; 2 -3,-1.625; 3 -2,-1.625; 4 -1,-1.625; 5 0,-1.625; 6 1,-1.625; 7 2,-1.625; 8 3,-1.625; 9 4,-1.625 | smd 1.2 x 1.8: FIT@1 5.3,0.9; FIT@2 -5.3,0.9
SM09B-SRSS-TB = smd 0.6 x 1.55: 1 -4,2.975; 2 -3,2.975; 3 -2,2.975; 4 -1,2.975; 5 0,2.975; 6 1,2.975; 7 2,2.975; 8 3,2.975; 9 4,2.975 | smd 1.2 x 1.8: FIT@1 -5.3,-0.9; FIT@2 5.3,-0.9
SM12B-SRSS-TB = smd 0.6 x 1.55: 1 -5.5,2.975; 2 -4.5,2.975; 3 -3.5,2.975; 4 -2.5,2.975; 5 -1.5,2.975; 6 -0.5,2.975; 7 0.5,2.975; 8 1.5,2.975; 9 2.5,2.975; 10 3.5,2.975; 11 4.5,2.975; 12 5.5,2.975 | smd 1.2 x 1.8: FIT@1 -6.8,-0.9; FIT@2 6.8,-0.9
MICRO-FIDUCIAL = smd 0.635 x 0.635: 1 0,0
SMD12R = smd 1.2 x 1.2: PAD 0,0
R0603 = smd 0.9 x 0.8: 1 -0.762,0; 2 0.762,0
SV01A103AEA01R00 = smd 1.8 x 2: 1 -2.5,-7.7; 2 0,-7.7; 2A 0,6.2; 3 2.5,-7.7
0603-RES = smd 1.1 x 1: 1 -0.85,0; 2 0.85,0
SMD10R = smd 1 x 1: PAD 0,0
KMR211GLFS = smd 0.9 x 1: 1A -2.05,0.8; 1B 2.05,0.8; 2A -2.05,-0.8; 2B 2.05,-0.8 | smd 1.7 x 0.55: M 0,1.425
SHORT_TOP-50 = smd 1.295 x 1.27: 1 0.635,0; 2 -0.635,0
TP-040 = drill 1.016 pad 2.159 octagon: 1 0,0
WQFN-24 = smd 0.8 x 0.25: 1 -2,1.25; 2 -2,0.75; 3 -2,0.25; 4 -2,-0.25; 5 -2,-0.75; 6 -2,-1.25; 13 2,-1.25; 14 2,-0.75; 15 2,-0.25; 16 2,0.25; 17 2,0.75; 18 2,1.25 | smd 0.25 x 0.8: 7 -1.25,-2; 8 -0.75,-2; 9 -0.25,-2; 10 0.25,-2; 11 0.75,-2; 12 1.25,-2; 19 1.25,2; 20 0.75,2; 21 0.25,2; 22 -0.25,2; 23 -0.75,2; 24 -1.25,2 | smd 2.6 x 2.6: EP 0,0
SOT23-5 = smd 0.55 x 1.2: 1 -0.95,-1.3; 2 0,-1.3; 3 0.95,-1.3; 4 0.95,1.3; 5 -0.95,1.3
QFN-44 = smd 0.8 x 0.3: 1 -3.4,2.5; 2 -3.4,2; 3 -3.4,1.5; 4 -3.4,1; 5 -3.4,0.5; 6 -3.4,0; 7 -3.4,-0.5; 8 -3.4,-1; 9 -3.4,-1.5; 10 -3.4,-2; 11 -3.4,-2.5; 23 3.4,-2.5; 24 3.4,-2; 25 3.4,-1.5; 26 3.4,-1; 27 3.4,-0.5; 28 3.4,0; 29 3.4,0.5; 30 3.4,1; 31 3.4,1.5; 32 3.4,2; 33 3.4,2.5 | smd 0.3 x 0.8: 12 -2.5,-3.4; 13 -2,-3.4; 14 -1.5,-3.4; 15 -1,-3.4; 16 -0.5,-3.4; 17 0,-3.4; 18 0.5,-3.4; 19 1,-3.4; 20 1.5,-3.4; 21 2,-3.4; 22 2.5,-3.4; 34 2.5,3.4; 35 2,3.4; 36 1.5,3.4; 37 1,3.4; 38 0.5,3.4; 39 0,3.4; 40 -0.5,3.4; 41 -1,3.4; 42 -1.5,3.4; 43 -2,3.4; 44 -2.5,3.4
10118192-0001LF = smd 0.4 x 1.35: 1 -1.3,4.1; 2 -0.65,4.1; 3 0,4.1; 4 0.65,4.1; 5 1.3,4.1 | smd 1.9 x 1.9: M1 -1.2,1.45; M2 1.2,1.45; S1 -3.85,1.45; S2 3.85,1.45 | smd 2.1 x 1.6: S3 -3.1,4; S4 3.1,4
CRYSTAL-SMD-5X3 = smd 1.9 x 1.1: 1 -1.85,-1.15; 2 1.85,-1.15; 3 1.85,1.15; 4 -1.85,1.15

### Placement (x,y rotation side)
C1  61.12,25.53 90 top
C2  66.68,6.48 0 top
C3  85.09,84.51 180 top
C4  56.52,18.23 0 top
C5  85.09,92.09 0 top
C6  61.6,11.08 90 top
C7  85.09,94.18 0 top
C8  23.66,32.52 270 top
C9  85.09,82.38 180 top
C10  70.96,9.66 270 top
C11  71.76,15.69 0 top
C14  66.2,29.82 270 top
C15  73.66,35.53 0 top
C16  73.66,33.47 0 top
C17  68.26,29.82 90 top
C18  30.83,32.52 270 top
C19  28.61,32.52 270 top
C20  25.72,32.52 90 top
C21  39.05,11.75 0 top
C22  33.15,17.59 90 top
C23  35.37,17.59 90 top
C24  85.09,86.15 0 top
C25  39.05,13.87 180 top
D1  48.26,12.11 0 top
D2  38.36,2.96 0 top
D3  58.16,2.96 180 top
F1  85.09,96.24 0 top
J2  48.26,23.96 180 bottom
J3  71.06,103 270 bottom
J4  48.26,2.71 180 top
J5  48.26,93.39 180 bottom
J7  25.46,103 90 bottom
JL  35.76,58.55 90 bottom
JP1  16.89,111.23 270 top
JP2  67.36,3.45 0 top
JR  60.76,58.55 270 bottom
PD6  71.76,17.59 0 top
PD8  71.76,19.18 0 top
R1  71.76,21.08 0 top
R2  59.4,11.08 90 top
R5  56.99,23.94 270 top
R6  82.15,88.46 270 top
R7  48.26,103 0 top
R8  27.31,12.32 180 top
R9  55.41,23.94 270 top
R10  51.44,56.77 0 top
R13  66.28,42.04 90 top
R14  68.03,42.04 90 top
R15  27.31,13.91 180 top
R16  64.69,42.04 90 top
R17  73.66,37.28 0 top
R24  36.67,40.33 0 top
R25  32.74,32.52 270 top
R26  27.31,10.73 180 top
R27  31.24,17.59 90 top
RST  56.02,14.26 0 top
S1  48.26,14.96 180 bottom
SH1  71.76,14.1 0 top
TP1  72.31,29.82 180 top
TP2  35.4,32.52 90 top
TP3  27.31,17.59 270 top
U1  66.68,35.69 180 top
U2  85.09,88.82 90 top
U7  30.96,38.23 90 top
U8  33.02,12.19 270 top
U$2  63.5,18.86 0 top
U$3  [FAB_FRAME_ANSI-A]  -81.31,-67.91 0 top  (outside the outline)
U$4  [FAB_DOCFIELD_GENERIC]  73.45,-67.68 0 top  (outside the outline)
USB1  48.26,130.41 180 top
Y1  66.68,9.66 0 top

### Tracks (layer width: path | path; a pad name or v marks a point on that pad's centre or on a via)
3V3  (via drill 0.36)
  Top 0.254: U8.21 35.81,11.94 v36.2,11.56 | U$2.14 62,14.5 60.8,13.31 | C6.2 61.6,12.51 60.8,13.31 | 60.8,13.31 v60.49,13.31 60.49,10.77 60.04,10.32 R2.1 | U$2.24 68.04,16.86 v68.58,16.32 | U$2.44 60.42,22.26 60.01,22.67 v60.01,23.47 | U$2.34 66.58,22.26 66.99,22.67 v66.99,23.47 | U7.20 v27.78,38.98
  Top 0.61: R27.2 v31.24,19.5 | R25.2 v32.74,30.61 | R14.2 67.15,42.89 | 67.15,42.89 R13.2 | v75.57,37.28 R17.2 | v67.15,43.95 67.15,42.89
  Bottom 0.406: v40.01,53.05 JL.1 | JR.12 v56.54,53.05
  Bottom 0.61: v48.26,89.03 J5.5
  other vias: 83.03,87.09 83.03,84.39 83.03,85.82
  pour Route15 (rank 2, no thermals): 21.12,-0.19 17.07,21.64 17.07,21.8 17.23,21.88 18.18,22.43 18.97,23.07 19.53,23.7 20,24.34 20.48,25.29 20.8,26.24 20.96,26.96 21.04,27.59 21.04,28.94 20.8,29.74 20.64,30.45 20.24,31.25 19.61,32.12 19.21,32.67 18.81,33.07 18.26,33.47 17.78,33.86 17.31,34.1 16.83,34.26 16.83,34.58 19.85,49.18 20.16,49.5 20.72,49.74 32.86,49.74 33.26,50.06 33.42,50.53 33.42,66.73 33.34,66.96 33.02,67.28 32.7,67.36 24.53,67.36 23.97,67.6 23.66,68 23.58,68.47 25.08,75.69 16.99,80.3 9.05,80.3 -0.24,85.78 arc-41 16.65,114.31 16.99,114.59 17.31,114.51 18.26,114.43 19.21,114.51 20.48,114.83 20.96,114.99 21.83,115.46 22.31,115.78 22.7,116.1 23.1,116.49 23.58,117.05 24.37,118.32 24.85,119.59 25,120.22 25.16,120.38 arc-34 41.53,126.59 42.55,126.65 42.55,130.7 53.98,130.7 53.98,126.65 54.89,126.57 arc-30 71.52,120.3 71.68,119.43 71.92,118.72 72.23,118.08 72.63,117.45 73.26,116.65 73.74,116.18 74.3,115.78 74.93,115.38 75.57,115.06 76.36,114.75 77.15,114.59 77.95,114.51 79.85,114.51 82.32,112.11 arc-33 96.54,86.6 96.76,85.62 87.39,80.22 79.54,80.22 71.52,75.62 72.95,68.47 72.79,68 72.55,67.68 72.07,67.36 63.82,67.36 63.58,67.28 63.26,67.04 63.1,66.65 63.1,50.3 63.34,49.98 63.58,49.82 63.9,49.74 76.12,49.74 76.52,49.42 76.76,49.1 79.69,34.5 79.69,34.34 78.74,33.78 78.11,33.39 77.39,32.67 76.68,31.8 76.28,31.09 75.88,30.29 75.65,29.42 75.49,28.47 75.49,27.36 75.8,26.01 76.12,25.05 76.76,24.02 77.31,23.39 77.87,22.83 78.34,22.43 78.98,22.04 79.46,21.72 75.41,-0.19
  pour Top (no thermals): 84.46,88.2 81.65,88.2 81.33,87.89 81.33,81.85 81.65,81.54 84.46,81.54 84.46,83.44 84.62,83.6 84.62,87.41 84.46,87.57
AREF
  Top 0.254: U$2.42 62,23.89 C1.1
B1  (via drill 0.36)
  Top 0.254: U1.18 64.08,34.44 63.9,34.26
  Top 0.406: v60.64,34.5 61.36,33.78 63.42,33.78 63.9,34.26
  Bottom 0.406: v60.64,34.5 60.49,34.66 60.49,47.04 60.03,47.7 60,49.61 60,50.02 60.3,50.52 60.3,52 60.29,52.68 61.49,53.39 61.98,53.77 61.86,58.81 61.57,59.06 58.32,59.05 JR.6
B2  (via drill 0.36)
  Top 0.254: U1.16 v61.52,35.44
  Route15 0.406: v60.39,60.79 60.66,59.82 60.66,50.02 v60.8,49.67
  Bottom 0.406: v61.52,35.44 61.2,35.76 61.2,47.44 v60.8,49.67 | JR.3 59.13,62.05 v60.39,60.79
B3  (via drill 0.36)
  Top 0.254: U1.14 63.15,36.44 62.95,36.64
  Top 0.406: 62.95,36.64 60.64,38.94 60.64,43.23 57.71,46.17 v49.85,46.17
  Bottom 0.406: JL.10 43.17,62.05 44.77,60.45 44.77,48.23 46.83,46.17 v49.85,46.17
B4  (via drill 0.36)
  Top 0.254: U7.18 29.71,40.75 v29.37,41.09
  Bottom 0.406: JL.7 42.13,59.05 43.34,57.84 43.34,52.84 40.88,50.37 40.88,44.18 37.78,41.09 v29.37,41.09
B5  (via drill 0.36)
  Top 0.254: U7.16 30.71,42.45 30.56,42.6
  Top 0.406: v36.2,87.95 36.2,48.71 34.61,47.12 34.1,46.33 32.23,46.33 30.48,44.58 30.48,42.67 30.56,42.6
  Bottom 0.406: J7.3 30.78,103.5 31.91,102.36 31.91,91.73 35.31,88.27 35.63,87.95 v36.2,87.95
B6  (via drill 0.36)
  Top 0.254: U7.14 31.71,42.63 32.07,42.99
  Top 0.406: v35.72,44.58 32.86,44.58 32.07,43.79 32.07,42.99
  Bottom 0.406: J3.2 58.72,103.5 53.34,108.87 43.82,108.87 41.12,108.87 36.99,104.75 36.99,91.57 36.99,57.28 36.99,48.39 35.72,47.12 v35.72,44.58
B7  (via drill 0.36)
  Top 0.254: U8.18 34.7,10.19 34.93,9.97
  Top 0.406: D1.1 44.16,13.81 v43.5,13.81 | 34.93,9.97 35.56,9.34 v43.5,9.34
  Bottom 0.406: v43.5,13.81 43.5,9.66 v43.5,9.34
B8  (via drill 0.36)
  Top 0.254: U8.16 33.27,9.09 33.97,8.39 33.97,7.75 33.97,7.11
  Top 0.406: J4.1 v52.26,5.65 | D2.1 v34.93,4.66 33.97,5.61 33.97,7.11
  Bottom 0.406: v52.26,5.65 50.86,4.26 43.82,4.26 42.23,5.84 37.47,5.84 36.28,4.66 v34.93,4.66
B9  (via drill 0.36)
  Top 0.254: U8.14 32.27,8.91 32.27,8.59 v31.91,8.23
  Top 0.406: D3.1 62.09,1.26 63.18,2.35 63.18,6.8 61.91,8.07 61.6,8.39 54.14,8.39 v49.26,8.39 | J4.4 v49.26,5.65
  Bottom 0.406: v49.26,5.65 v49.26,8.39 38.58,8.39 37.94,9.02 36.36,9.02 33.97,9.02 32.7,9.02 v31.91,8.23
D8
  Top 0.254: U$2.28 69.38,18.86 69.69,19.18 PD8.PAD
D12
  Top 0.254: U$2.26 69.42,17.86 69.69,17.59 PD6.PAD
D+
  Top 0.254: 57.58,19.86 57.55,19.89
  Top 0.305: U$2.4 58.58,19.86 57.58,19.86 | 57.55,19.89 57.47,19.97
  Top 0.406: R9.2 55.87,23.18 55.87,22.43 55.87,21.57 57.47,19.97
D-
  Top 0.254: 58.03,20.36 57.95,20.45
  Top 0.305: U$2.3 58.58,20.36 58.03,20.36
  Top 0.406: R5.2 56.53,23.18 56.53,22.36 56.53,21.87 57.95,20.45
G1  (via drill 0.36)
  Top 0.254: U1.19 64.44,33.69 64.22,33.47
  Top 0.406: v59.77,33.78 60.49,33.07 63.82,33.07 64.22,33.47 | v58.68,51.18 58.93,51.69 58.93,56.26 v59.44,57.03
  Bottom 0.406: v59.77,33.78 59.77,43.47 58.5,44.74 58.52,50.42 v58.68,51.18 | JR.8 58.43,57.04 v59.44,57.03
G2  (via drill 0.36)
  Top 0.254: U1.17 63.23,34.94 v62.95,34.66
  Route15 0.406: v61.51,63.12 62.23,62.66 62.28,48.79 v62.99,46.87
  Bottom 0.406: v62.95,34.66 62.95,46.39 v62.99,46.87 | JR.1 59.83,64.05 v61.51,63.12
G3  (via drill 0.36)
  Top 0.254: U1.15 62.54,35.94 62.31,36.17
  Top 0.406: 62.31,36.17 59.93,38.55 59.93,42.83 57.47,45.29 v52.31,45.29
  Bottom 0.406: JL.12 45.46,64.05 51.04,58.47 51.04,49.9 50.4,49.26 50.4,47.04 v52.31,45.29
G4  (via drill 0.36)
  Top 0.254: U7.19 28.96,39.91 28.74,40.13
  Top 0.406: 28.74,40.13 28.26,40.61 28.26,42.36 v28.74,42.83
  Bottom 0.406: v28.74,42.83 37.31,42.83 39.45,44.98 39.45,51.17 41.91,53.63 41.91,56.33 41.19,57.05 JL.5
G5  (via drill 0.36)
  Top 0.254: U7.17 30.21,41.68 30.01,41.88
  Top 0.406: v34.61,85.98 34.61,49.42 32.39,47.2 31.91,47.2 29.69,44.98 29.69,42.2 30.01,41.88
  Bottom 0.406: J7.1 29.6,101.5 30.01,101.09 30.01,91.09 34.29,86.74 34.61,86.43 v34.61,85.98
G6  (via drill 0.36)
  Top 0.254: U7.15 31.21,43.24 31.28,43.31
  Top 0.406: v39.12,85.73 38.61,85.22 38.58,47.28 36.75,45.45 32.55,45.45 31.28,44.18 31.28,43.31
  Bottom 0.406: J3.4 57.86,101.5 52.39,106.97 41.75,106.97 38.58,103.79 38.61,88.27 39.12,87.51 v39.12,85.73
G7
  Top 0.254: U8.19 35.54,10.94 35.88,10.61
  Top 0.406: 35.88,10.61 36.08,10.41 D1.3
G8  (via drill 0.36)
  Top 0.254: U8.17 33.77,9.54 34.29,9.02
  Top 0.406: D2.3 v34.93,1.26 | J4.2 v51.26,2.99 | 34.29,9.02 34.93,8.39 v34.93,6.16
  Bottom 0.406: v51.26,2.99 51.26,2.5 51.12,2.35 50.88,2.11 45.01,2.11 42.86,2.11 37.47,2.11 D2.3 v34.93,1.26 33.82,2.37 33.82,3.15 33.82,5.05 v34.93,6.16
G9  (via drill 0.36)
  Top 0.254: U8.15 32.77,8.32 v33.02,8.07
  Top 0.406: J4.5 v48.26,5.65 48.26,6 48.9,6.64 52.71,6.64 59.22,6.64 59.91,5.94 D3.3
  Bottom 0.406: v33.02,8.07 37.31,8.07 37.94,7.43 41.28,7.43 47.31,7.43 48.26,6.48 v48.26,5.65
GND  (via drill 0.36)
  Top 0.254: U8.20 33.14,11.44 v33.02,11.56 | U8.4 32.77,13.08 v33.02,12.83 U8.EP | U8.6 31.34,14.19 v30.8,14.73 | U7.4 31.21,37.34 v30.96,37.59 | U7.21 30.07,38.48 v30.32,38.23 | U7.6 32.21,35.71 32.55,35.37 v32.86,35.37 | U$2.15 62.5,13.73 v62.07,13.31 | U$2.23 66.9,15.94 | v54.45,18.23 54.45,19.02 54.79,19.36 U$2.5 | U$2.43 61.5,23.08 v61.12,23.47 | U$2.33 v67.95,21.36 | U$2.35 65.5,23.08 v65.88,23.47 | U1.21 66.43,34.81 v66.68,35.06 | U1.4 67.56,35.94 v67.31,35.69 | U1.20 65.93,35.58 v66.04,35.69 U1.EP | U1.6 69.67,36.94 v70.33,37.59
  Top 0.305: 66.9,15.94 66.9,15.14 67.31,14.73
  Top 0.406: v68.58,14.1 67.95,14.1 67.31,14.73
  Top 0.61: R26.2 v25.08,10.73 | C22.2 v33.15,19.5 | C21.2 v40.96,11.75 | D2.4 v41.59,4.66 | D2.5 v41.59,2.96 | D2.6 v41.59,1.26 | J4.9 v44.26,5.65 | J4.8 v45.26,5.65 | J4.7 v46.26,5.65 | D3.6 v54.93,4.66 | D3.5 v54.93,2.96 | D3.4 v54.93,1.26 | D1.6 v51.75,10.41 | D1.5 v51.75,12.11 | D1.4 v51.75,13.81 | C8.2 v23.66,30.61 | R24.2 v38.58,40.33 | v30.83,30.61 C18.2 | v30.96,37.59 U7.EP | v68.58,6.48 C2.2 | C10.2 v70.96,7.75 | v61.6,9.34 C6.1 | v87.47,88.82 U2.2 v85.25,88.82 | v68.58,14.1 SH1.2 | R1.2 v73.82,21.08 | C4.1 v54.45,18.23 | C1.2 v61.12,27.44 | R16.2 v64.69,43.95 | v75.57,35.53 C15.2 | v66.2,27.83 C14.2
  Bottom 0.406: v40.8,60.05 JL.8 | v56.52,60.05 JR.5
  Bottom 0.61: S1.1B 51.4,14.17 v51.75,13.81 | S1.1A 44.83,14.17 v44.13,14.86 | J3.1 v66.68,104.5 | J7.4 v29.85,104.5 | J5.3 v46.26,89.03
  other vias: 32.39,12.19 33.66,12.19 30.96,38.86 31.59,38.23 46.04,124.43 87.16,86.15 87.16,84.51 87.95,81.81 87.95,82.76 83.35,94.24 82.39,92.65 82.39,91.54 45.09,124.43 45.56,123.48 66.68,36.33
  pour GND (rank 2, no thermals): 20.88,-0.58 16.75,22.04 17.15,22.2 17.54,22.43 18.02,22.75 18.58,23.15 19.05,23.55 19.45,24.1 19.77,24.58 20,25.21 20.32,25.69 20.64,27.12 20.72,27.67 20.72,28.39 20.64,29.02 20.4,29.66 20.24,30.29 20,30.77 19.77,31.17 19.45,31.56 19.13,32.04 18.89,32.36 18.58,32.67 18.18,32.99 17.62,33.47 17.07,33.78 16.43,34.02 16.43,34.26 16.51,34.66 19.53,49.26 19.77,49.58 20.16,49.9 20.64,50.14 32.7,50.14 32.94,50.37 33.1,50.77 33.1,66.57 33.02,66.81 32.78,66.96 32.55,67.04 24.05,67.04 23.73,67.28 23.42,67.68 23.26,68.15 23.26,68.55 24.69,75.54 16.99,79.9 8.97,79.9 -0.55,85.54 0.08,89.42 arc-40 16.91,114.91 17.46,114.83 18.89,114.83 19.61,114.99 20.24,115.14 20.96,115.38 21.59,115.7 22.07,116.02 22.46,116.34 22.94,116.81 23.34,117.37 23.81,118.08 24.21,118.8 24.45,119.59 24.8,120.67 27.53,122.5 arc-31 42.23,126.98 42.23,130.94 54.29,130.94 54.29,126.97 55.73,126.82 arc-29 71.3,120.93 71.84,120.54 71.92,120.22 71.99,119.67 72.23,118.88 72.63,118.08 73.03,117.61 73.34,117.13 73.98,116.49 74.61,116.02 75.41,115.54 76.28,115.14 77.23,114.91 78.11,114.83 80.01,114.83 81.66,113.34 arc-33 96.13,89.44 97.16,85.46 87.39,79.9 79.69,79.9 71.92,75.46 73.34,68.55 73.19,67.92 72.87,67.44 72.23,67.04 63.9,67.04 63.58,66.88 63.42,66.57 63.42,50.45 63.74,50.14 76.28,50.14 76.36,49.98 80.17,34.02 79.85,33.94 79.38,33.71 78.42,33.15 77.55,32.28 76.68,31.09 76.28,30.13 75.96,29.02 75.88,27.59 76.04,26.48 76.44,25.37 76.92,24.5 77.63,23.62 78.58,22.75 79.14,22.36 79.93,21.88 75.65,-0.58
  pour Top (no thermals): 85.57,83.6 85.57,86.62 85.73,86.78 88.27,86.78 88.43,86.62 88.43,81.7 88.27,81.54 85.73,81.54 85.73,83.44
  pour Top (no thermals): 84.77,94.55 83.03,94.55 81.92,93.13 81.92,91.54 82.23,91.22 84.46,91.22 84.46,93.13 84.77,93.6
  pour Top (no thermals): 46.83,126.97 46.83,125.22 46.52,124.91 44.93,124.91 44.61,124.59 44.61,123.32 44.93,123 46.67,123 47.03,123.48 47.03,126.97
GND_POT  (via drill 0.36)
  Top 0.61: SH1.1 72.52,14.23 C11.2 v73.74,15.69 | R10.1 48.52,56.77 48.32,56.57 v48.26,56.57
  GND 0.406: 55.37,54.74 v55.63,54.99 55.63,55.06 55.72,55.06
  GND 0.813: v40.01,55.05 47.73,55.07 v48.26,56.57 | v49.26,87.6 48.26,86.6 v48.26,56.57 | v54.45,20.61 56.36,22.51 56.36,41.8 53.98,44.18 53.98,53.3 | 48.27,55.06 v48.26,56.57 | 55.72,55.06 55.72,55.05 53.98,53.3 | v48.26,56.57 52.23,55.05 53.98,53.3
  Bottom 0.406: v40.01,55.05 JL.3 | JR.10 v55.63,54.99
  Bottom 0.61: J5.6 v49.26,87.6 | v73.74,15.69 73.74,14.97 70.88,12.12 55.88,12.12 53.02,14.97 53.02,19.18 v54.45,20.61
HOR_C  (via drill 0.36)
  Top 0.254: U$2.38 64,27.46 v64.37,27.83
  Bottom 0.406: J5.9 52.26,62.8 54.61,60.45 54.61,59.26 54.61,58.39 54.61,51.25 54.61,43.95 56.75,41.8 56.75,32.91 56.75,31.64 58.66,29.74 59.93,29.74 61.44,29.74 62.95,29.74 63.82,29.74 64.37,29.18 v64.37,27.83
HOR_L  (via drill 0.36)
  Top 0.254: U$2.36 65,23.7 v65.88,24.5
  Top 0.406: v40.86,54.05 41.75,53.15 v41.75,49.92
  Bottom 0.406: v65.88,24.5 58.34,24.5 54.45,28.39 44.13,28.39 39.45,33.07 39.45,41.64 41.75,43.95 v41.75,49.92 | v40.86,54.05 JL.2
HOR_R  (via drill 0.36)
  Top 0.254: U$2.40 63,27.94 62.79,28.15
  Top 0.406: v62.63,30.61 62.63,28.31 62.79,28.15
  Bottom 0.406: v62.63,30.61 60.56,30.61 58.18,32.99 58.18,42.83 57.07,43.95 57.1,51.49 56.49,52.05 55.48,52.61 55.48,53.77 56.03,54.03 JR.11
IRQ
  Top 0.254: U$2.29 68.61,19.36 70.33,21.08 R1.1
LED_EN_1_3
  Top 0.254: 72.68,37.28 R17.1 | U1.5 70.76,36.44 71.12,36.8
  Top 0.406: R17.1 71.6,37.28 71.12,36.8
LED_EN_4_6
  Top 0.254: U7.5 31.71,35.26 32.7,34.26 32.7,33.4 R25.1
LED_EN_7_9
  Top 0.254: U8.5 32.27,14.85 31.43,15.69 31.24,15.88 R27.1
MISO
  Top 0.254: J2.1 46.02,25.23 46.99,24.26 46.99,17.91 47.63,17.28 51.06,17.28 52.96,15.37 59.06,15.37 60.05,16.36 U$2.11
MOSI
  Top 0.254: U$2.10 59.6,16.86 59.22,16.48 53.34,16.48 48.26,21.56 J2.4
N$1
  Top 0.254: U$2.16 63,13.17 63.98,12.19 66.04,12.19 66.36,11.88 66.36,9.66 65.57,8.86 | 65.57,8.86 65.18,8.86 Y1.1 | C2.1 65.64,6.48 65.64,8.23 65.57,8.23 65.57,8.86
N$2
  Top 0.254: U$2.17 63.5,13.62 64.3,12.83 66.36,12.83 66.99,12.19 66.99,11.08 67.27,10.81 Y1.3 69.06,10.81 69.06,10.61 70.96,10.61 C10.1
N$3  (via drill 0.36)
  Top 0.254: U1.7 67.93,38.21 68.11,38.39
  Top 0.406: 68.11,38.39 68.34,38.63 v69.61,38.63
  Bottom 0.406: v69.61,38.63 70.57,38.63 71.2,37.99 71.2,36.8 70.88,36.48 70.88,34.9 72.31,33.47 TP1.1
N$4
  Top 0.254: U$2.6 58.42,18.86 57.95,18.39 57.44,18.39 C4.2
N$5
  Top 0.254: U7.2 30.21,35.58 28.89,34.26 28.89,33.65 C19.1
N$7
  Top 0.61: R7.3 53.52,95.3 55.12,96.9 65.79,96.9 66.3,96.4 66.66,96.06 70.46,92.5 77.96,92.5 79.35,89.28 81.88,89.28 R6.1
N$9
  Top 0.254: U7.24 28.28,36.98 28.1,36.8
  Top 0.406: C19.2 27.52,31.67 27.15,32.04 27.15,35.06 27.15,35.85 28.1,36.8
N$10
  Top 0.61: R7.1 42.78,95.3 41.28,93.79 41.28,90.94 46.99,85.22 50.8,85.22 52.33,83.7 R10.2
N$11
  Top 0.254: U1.2 70.6,34.94 70.96,34.58
  Top 0.406: 70.96,34.58 72.07,33.47 C16.1
N$12
  Top 0.254: U1.24 68.36,33.69 68.58,33.47
  Top 0.406: 68.58,33.47 70.01,32.04 74.04,32.04 74.51,32.52 C16.2
N$13  (via drill 0.36)
  Top 0.254: U1.1 69.51,34.44 69.85,34.1
  Top 0.406: C17.1 v70.33,28.97 | v70.33,33.31 69.85,34.1
  Bottom 0.406: v70.33,33.31 v70.33,28.97
N$14
  Top 0.254: U1.23 67.43,33.03 67.79,32.67
  Top 0.406: 67.79,32.67 68.26,32.2 C17.2
N$21  (via drill 0.36)
  Top 0.254: U7.1 29.71,35.87 29.05,35.21 v28.58,35.21
  Top 0.406: C20.1 v25.72,30.61
  Bottom 0.406: v25.72,30.61 25.72,32.36 v28.58,35.21
N$22
  Top 0.254: U7.23 27.51,37.48 27.31,37.28
  Top 0.406: C20.2 25.72,34.42 25.72,35.69 27.31,37.28
N$23
  Top 0.254: U7.7 33.32,36.98 33.66,36.64
  Top 0.406: 33.66,36.64 33.97,36.33 34.13,36.17 34.13,33.78 TP2.1
N$24
  Top 0.254: U8.2 33.77,14.85 34.61,15.69 34.61,15.98 C23.1
N$25  (via drill 0.36)
  Top 0.254: U8.24 35.54,13.44 35.88,13.78 v35.88,14.1
  Top 0.61: C23.2 v35.37,19.5
  Bottom 0.406: v35.88,14.1 35.88,18.99 v35.37,19.5
N$26
  Top 0.254: C25.1 39.9,14.52 39.69,14.73 39.37,15.05 36.51,15.05 34.93,15.05 34.27,14.4 U8.1
N$27
  Top 0.254: U8.23 35.99,12.94 36.83,13.78 36.92,13.87 C25.2
N$28
  Top 0.254: U8.7 30.5,13.44 29.53,14.42 29.53,14.73
  Top 0.406: 29.53,14.73 29.53,16.96 28.89,17.59 TP3.1
R1  (via drill 0.36)
  Top 0.254: U1.13 63.76,36.94 63.58,37.12
  Top 0.406: 63.58,37.12 61.36,39.34 61.36,44.1 v59.45,46.01
  Bottom 0.406: v56.52,58.05 JR.7 58.13,58.05 58.68,58.05 | 58.68,58.05 58.93,58.04 | v59.45,46.01 59.29,46.87 59.29,50.32 59.59,50.78 59.59,53.16 60.71,53.98 60.71,57.28 59.69,58.04 58.68,58.05
R2  (via drill 0.36)
  Top 0.254: 64.68,37.69 U1.12
  Top 0.406: 64.68,37.69 64.44,37.69 62.07,40.06 v62.07,45.06
  Route15 0.406: v60.85,62.2 61.47,61.09 v61.46,50.52
  Bottom 0.406: JR.2 59.24,63.05 v60.85,62.2 | v61.46,50.52 62.07,50.22 v62.07,45.06
R3  (via drill 0.36)
  Top 0.254: U1.11 65.93,38.34 65.57,38.71 65.09,38.71 64.93,38.86
  Top 0.406: v48.9,47.04 61.6,47.04 63.42,45.22 63.42,40.37 64.93,38.86
  Bottom 0.406: JL.11 43.44,63.05 45.48,61.01 45.48,48.63 47.07,47.04 v48.9,47.04
R4  (via drill 0.36)
  Top 0.254: U7.13 32.21,41.62 v32.55,41.96
  Bottom 0.406: v32.55,41.96 37.55,41.96 40.17,44.58 40.17,50.77 42.63,53.23 42.63,57.36 41.94,58.05 JL.6
R5  (via drill 0.36)
  Top 0.254: U7.12 33.32,39.48 33.5,39.66 33.5,41.72
  Top 0.406: v35.4,86.97 35.4,49.02 v33.5,47.12 | 33.5,41.72 v33.5,43.71
  Bottom 0.406: J7.2 30.35,102.5 30.96,101.89 30.96,91.41 v35.4,86.97 | v33.5,47.12 v33.5,43.71
R6  (via drill 0.36)
  Top 0.254: U7.11 33.61,38.98 34.13,39.5 34.13,41.01 34.29,41.17
  Top 0.406: v37.78,48.07 v37.85,87 | v36.83,43.71 34.29,41.17
  Bottom 0.406: J3.3 58.29,102.5 52.87,107.92 41.44,107.92 37.78,104.27 37.85,88.01 v37.85,87 | v36.83,43.71 36.83,47.12 v37.78,48.07
R7  (via drill 0.36)
  Top 0.254: U8.13 31.77,9.67 v31.43,9.34
  Top 0.406: D1.2 45.32,12.11 v42.23,12.11
  Bottom 0.406: v31.43,9.34 32.39,10.29 38.74,10.29 41.28,10.29 42.23,11.24 v42.23,12.11
R8  (via drill 0.36)
  Top 0.254: U8.12 30.8,10.94 30.5,10.94 30.48,10.92 30.16,10.61 30.16,10.29
  Top 0.406: D2.2 v34.93,2.96 34.32,2.96 31.12,6.16 30.8,6.48 30.16,7.11 30.16,10.29 | J4.3 v50.26,2.99
  Bottom 0.406: v34.93,2.96 36.49,2.96 37.34,3.81 40.96,3.81 42.55,3.81 43.37,2.99 v50.26,2.99
R9  (via drill 0.36)
  Top 0.254: U8.11 30.37,11.44 29.21,10.29 v29.21,7.11
  Top 0.406: D3.2 61.57,2.96 62.23,3.62 62.23,6.16 61.28,7.11 60.96,7.43 53.34,7.43 48.26,7.43 47.26,6.43 v47.26,5.65 J4.6
  Bottom 0.406: v29.21,7.11 34.45,7.11 36.99,7.11 37.47,6.64 41.28,6.64 46.67,6.64 47.26,6.05 v47.26,5.65
RESET  (via drill 0.36)
  Top 0.254: U$2.13 61.5,14.8 60.96,14.26 60.17,14.26 59.4,13.49 | 59.4,13.49 R2.2 | RST.PAD 58.62,14.26 59.4,13.49
  Top 0.406: v48.26,15.77 51.42,15.77 52.83,14.35 55.88,14.35 RST.PAD
  Bottom 0.254: J2.5 49.53,23.96 49.53,19.81 48.26,18.55 v48.26,15.77
  Bottom 0.406: S1.2A v48.26,15.77 S1.2B
SCK
  Top 0.254: U$2.9 59.3,17.36 59.06,17.12 57.79,17.12 53.66,17.12 49.53,21.24 49.53,22.04 49.53,23.96 J2.3
SCL  (via drill 0.36)
  Top 0.254: U$2.18 64,14.08 64.45,13.62 v64.93,13.62 | U1.9 66.93,39.49 v66.28,40.13 | U7.9 34.52,37.98 34.7,37.91
  Top 0.406: v66.28,40.13 R13.1 | v52.31,47.91 v63.9,47.91 | 34.7,37.91 34.96,37.56 35.18,37.34 | 35.18,37.34 38.1,34.42 38.1,26.8 36.32,25.02 26.16,25.02 23.62,22.48 23.62,15.88 v24.39,15.12 | v24.39,12.32 R8.2 | v36.58,37.72 35.56,37.72 35.18,37.34
  Route15 0.406: v52.31,47.91 46.77,47.91 40.9,42.04 40.9,39.5 39.63,38.23 37.09,38.23 v36.58,37.72
  Bottom 0.406: J5.2 45.26,66.47 52.47,59.26 52.47,48.07 v52.31,47.91 | v64.93,13.62 64.93,14.42 65.57,15.05 69.06,15.05 69.53,14.58 70.8,14.58 72.07,15.85 72.07,24.58 68.58,28.07 68.58,37.12 66.28,39.42 v66.28,40.13 66.28,45.53 v63.9,47.91 | v24.39,15.12 v24.39,12.32
SCL2
  Top 0.254: U8.9 29.46,12.44 29.34,12.32 R8.1
SDA  (via drill 0.36)
  Top 0.254: U$2.19 64.5,14.85 64.93,14.42 65.72,14.42 66.04,14.1 v66.04,13.62 | U1.8 67.43,39.54 v68.03,40.13 | U7.8 34.09,37.48 34.34,37.23
  Top 0.406: v68.03,40.13 R14.1 | v68.03,45.53 64.77,48.79 v51.28,48.79 | 34.34,37.23 35.05,36.52 35.05,36.45 35.18,36.33 35.31,36.2 | 35.31,36.2 37.09,34.42 37.09,27.05 35.82,25.78 25.66,25.78 22.86,22.99 22.86,15.12 23.88,13.85 26.27,13.85 R15.2 | v35.31,35.44 35.31,36.2
  Route15 0.406: v51.28,48.79 46.37,48.79 40.13,42.55 40.13,40.01 39.12,38.99 v35.56,38.99
  Bottom 0.406: J5.1 44.26,66.36 51.75,58.87 51.75,49.26 v51.28,48.79 | v66.04,13.62 66.52,13.15 70.65,13.15 72.87,15.37 72.87,24.89 69.38,28.39 69.38,37.59 68.03,38.94 v68.03,40.13 v68.03,45.53 | v35.56,38.99 35.56,35.69 v35.31,35.44
SDA2
  Top 0.254: U8.8 30.05,12.94 29.08,13.91 R15.1
SEL_C  (via drill 0.36)
  Top 0.254: U$2.27 v70.33,18.36
  Bottom 0.406: J5.7 50.26,67.03 50.26,62.58 53.18,59.66 53.18,59.42 53.18,51.25 53.18,43.15 55.33,41.01 55.33,39.26 55.33,34.58 55.33,32.12 55.33,30.85 57.87,28.31 59.14,28.31 61.6,28.31 62.95,26.96 64.22,26.96 66.36,26.96 66.99,26.96 70.33,23.62 70.33,23.07 v70.33,18.36
SEL_L  (via drill 0.36)
  Top 0.254: U$2.31 68.26,20.36 68.74,20.85 v68.74,23.47
  Bottom 0.406: JL.9 42.35,61.05 44.05,59.34 44.05,49.18 43.5,48.63 43.5,43.47 40.88,40.85 40.88,33.86 44.85,29.9 55.17,29.9 58.82,26.24 65.96,26.24 v68.74,23.47
SEL_R  (via drill 0.36)
  Top 0.254: 59.14,23.94 59.14,22.59 60.1,21.63 U$2.1
  Top 0.406: 59.14,23.94 v59.14,30.61 | v55.21,61.05 54.61,60.45 54.61,52.44 v55.72,51.33
  Bottom 0.406: v59.14,30.61 57.47,32.28 57.47,42.44 56.36,43.55 56.36,50.69 v55.72,51.33 | JR.4 v55.21,61.05
TRIG_1_3
  Top 0.254: U1.10 66.43,38.72 65.33,39.82
  Top 0.406: 65.33,39.82 64.69,40.45 R16.1
TRIG_4_6
  Top 0.254: U7.10 34.07,38.48 34.37,38.79
  Top 0.406: R24.1 35.12,40.33 34.77,39.98 34.77,39.18 34.37,38.79
TRIG_7_9
  Top 0.254: U8.10 30.23,11.94 29.21,10.92 29.02,10.73 R26.1
USB_N
  Top 0.406: USB1.2 48.91,122.71 46.97,120.77 39.83,120.77 38.27,119.21 38.27,89.8 41.55,86.5 41.55,62.3 44.46,59.48 44.46,46.27 40.26,42.06 40.26,33.29 44.35,29.19 53.32,29.19 56.53,25.98 56.53,24.7 R5.1
USB_P
  Top 0.406: USB1.3 48.26,122.99 46.7,121.43 39.55,121.43 37.61,119.49 37.61,89.53 40.9,86.24 40.9,62.11 43.8,59.21 43.8,46.54 39.6,42.34 39.6,33.01 44.08,28.53 53.05,28.53 55.87,25.71 55.87,24.7 R9.1
UVCC  (via drill 0.36)
  Top 0.254: U$2.7 59.19,18.36 v58.9,18.07 | U$2.2 59.44,20.86 58.9,21.4 v58.9,21.56
  Top 0.61: 50.09,119.35 41.28,119.35 39.93,118 39.93,90.22 42.93,87.25 42.93,62.84 45.48,60.28 45.48,45.61 41.12,41.25 41.12,33.78 44.85,30.05 53.9,30.05 58.34,25.61 58.34,22.12 v58.9,21.56
  Bottom 0.406: v58.9,18.07 v58.9,21.56
  pour Top (no thermals): 84.3,95.19 84.3,97.57 83.5,100.59 83.5,102.33 84.14,108.87 79.38,113.64 77.15,113.64 76.04,113.95 74.77,114.43 73.19,115.54 72.07,116.81 71.12,118.4 70.8,119.67 69.53,120.46 68.58,120.94 65.88,122.21 64.3,122.84 61.76,123.8 57.95,124.91 50.01,124.91 49.69,125.22 49.69,126.97 49.49,126.97 49.65,119.23 50.17,118.72 54.77,118.72 55.88,117.61 55.88,111.73 59.06,108.56 67.91,108.56 70.39,102.78 70.39,95.16 82.55,95.19
VER_C  (via drill 0.36)
  Top 0.254: U$2.39 63.5,27.83 v63.5,28.7
  Bottom 0.406: J5.8 51.26,62.69 53.9,60.06 53.9,56.96 53.9,51.25 53.9,43.55 56.04,41.41 56.04,32.52 56.04,31.25 58.26,29.02 59.53,29.02 63.18,29.02 v63.5,28.7
VER_L  (via drill 0.36)
  Top 0.254: U$2.37 64.5,24.86 v64.77,25.37
  Top 0.406: v40.71,56.05 41.91,56.01 42.78,54.74 v42.78,49.94
  Bottom 0.406: v42.78,49.94 42.78,43.87 40.17,41.25 40.17,33.47 44.53,29.1 54.85,29.1 58.58,25.37 v64.77,25.37 | v40.71,56.05 JL.4
VER_R  (via drill 0.36)
  Top 0.254: U$2.41 62.5,27.4 62.07,27.83
  Top 0.406: v61.76,31.48 61.76,28.15 62.07,27.83 | v56.39,56.01 57.66,56.01 57.86,55.25 v57.86,51.9
  Bottom 0.406: v61.76,31.48 60.8,31.48 58.9,33.39 58.9,43.23 57.79,44.34 57.81,51.69 | JR.9 v56.39,56.01 | 57.81,51.69 57.81,51.9 | v57.86,51.9 57.81,51.69
VOUT_1_3
  Top 0.254: U1.22 66.93,32.92 66.68,32.67
  Top 0.406: 66.68,32.67 66.2,32.2 C14.1
VOUT_3_6
  Top 0.254: U7.22 26.74,37.98 26.51,37.75
  Top 0.406: C8.1 23.66,34.9 26.51,37.75
VOUT_7_9
  Top 0.254: U8.22 36.58,12.44 37.28,11.75 C21.1
VUSB_FUSED  (via drill 0.36)
  Top 0.254: U8.3 33.27,15.56 v33.15,15.69 | U7.3 30.71,34.54 v30.83,34.42 | U1.3 69.6,35.44 69.69,35.53
  Top 0.406: v33.15,15.69 C22.1 | C18.1 v30.83,34.42 | 69.69,35.53 v71.76,35.53 C15.1
  Route15 0.813: v51.75,27.28 v52.71,27.28 | v71.76,35.53 69.93,35.53 67.79,37.67 57.79,37.67 57.79,37.52 | v47.26,87.76 49.4,85.62 v57.79,85.62
  Route15 1.27: v52.71,27.28 56.28,27.28 57.79,28.78 57.79,37.52 57.79,44.66 54.87,47.88 52.58,50.17 52.58,63.63 57.79,68.84 v57.79,85.62 v63.18,90.46
  Bottom 0.406: v30.83,34.42 31.75,33.5 31.75,29.9 34.37,27.28 32.23,25.13 32.23,16.61 v33.15,15.69
  Bottom 0.61: J5.4 v47.26,87.76
  Bottom 0.813: v52.71,27.28 v51.75,27.28 34.37,27.28
  Bottom 1.27: v88.58,90.27 v87.47,90.27 87.06,90.52 83.82,90.55 82.55,89.79 80.65,90.46 v63.18,90.46 v57.79,85.62
  pour Top (no thermals): 86.04,95.03 86.04,97.51 88.43,97.51 90.33,97.41 90.65,96.62 90.65,88.05 90.01,87.41 85.89,87.41 85.89,88.05 87.95,88.05 88.27,88.36 88.27,89.32 87.95,89.63 85.89,89.63 85.89,94.87
WHEEL  (via drill 0.36)
  Top 0.254: U$2.25 68.97,17.36 69.85,16.48 v69.85,15.69
  Top 0.406: C11.1 v69.85,15.69 | R7.2A 44.61,105.55 44.61,101.25 48.26,97.6 R7.2 48.26,91.57 53.8,86.03 53.8,51.58 v55.48,49.9 | v63.26,32.2 63.1,32.36 59.93,32.36 58.9,33.39 58.9,41.01 v55.48,44.42
  Bottom 0.406: v69.85,15.69 71.2,17.04 71.2,24.26 v63.26,32.2 | v55.48,44.42 v55.48,49.9

### Text on the board
tNames: PLA_MAIN_G2R4 | EHMC | F1 | C7 | C5 | U2 | C24 | C3 | C9 | R9 | R5 | C1 | R1 | C4 | RST | Y1 | R2 | C6 | C10 | C2
bNames: MISO | SCK | RESET | J2 | 3V3 | MOSI | GND | PLA_G2R4
Document: PLA CONTROLLER MAIN BOARD (1 PER) | FILES | Board stackup (mm) / / Layer 1 0.035 foil thickness / Bonding ply 0.3 Dielectric Constant 4.5 (+/- 0.10) / Layer 2 0.035 foil thickness / Laminate Core 0.85 Dielectric Constant 4.5 (+/- 0.10) / Layer 3 0.035 foil thickness / Bonding ply 0.3 Dielectric Constant 4.5 (+/- 0.10) / Layer 4 0.035 foil thickness / / Total Thickness 1.59 | NOTES: | 1. PRINTED CIRCUIT BOARD MADE FROM NEMA GRADE FR-4 EPOXY LAMINATE | WITH 1 OUNCE COPPER PLATING AND .063 THICKNESS. | DRL =DRILL TOOL SIZE INFORMATION (INCHES) / DRD =JOB DRILL DATA (NC DRILL LOCATION INFO) / OLN =OUTLINE / L1 =TOP LAYER (POS LAYER) / SLK=SILKSCREEN TOP / BSK=SILKSCREEN BOT / SMT=SOLDER MASK TOP / SMB=SOLDER MASK BOT / L2 =INNER LAYER 1 / L3 =INNER LAYER 2 / L4 =BOT LAYER / TPS=TOP STENCIL / BPS=BOTTOM STENCIL / MNT=PLACE FILE TOP / MNB=PLACE FILE BOTTOM / BOM= BILL OF MATERIALS / SCHEMATIC / FABDRAWING | 2. ALL DIMENSIONS ARE GIVEN IN INCHES. | 3. CIRCUIT PATHS ARE FOR REFERENCE ONLY. | 4. HOLE SIZES SHOWN ARE FINISHED DIAMETERS AFTER PLATING. | 5. BOARD PLATED USING REFLOW OR SIMILAR METHOD. | 6. APPLY GREEN SOLDER MASK ON PLATED SURFACES USING WET FILM SR100 | OR SR1010 EPOXY. EQUIVALENT WET OR DRY FILM MAY BE USED. | 7. SILKSCREEN TOP and BOTTOM SIDE USING WHITE INK. | 8. THE FOLLOWING INFORMATION APPLIES TO THIS BOARD: | A) 4 COPPER LAYERS | B) 0.063 BOARD THICKNESS | C) REQUIRES TOP AND BOTTOM SILKSCREEN